# EAGLE design sbmcs-pcb (EAGLE 9.6.2)

## Sheet 1 of 4
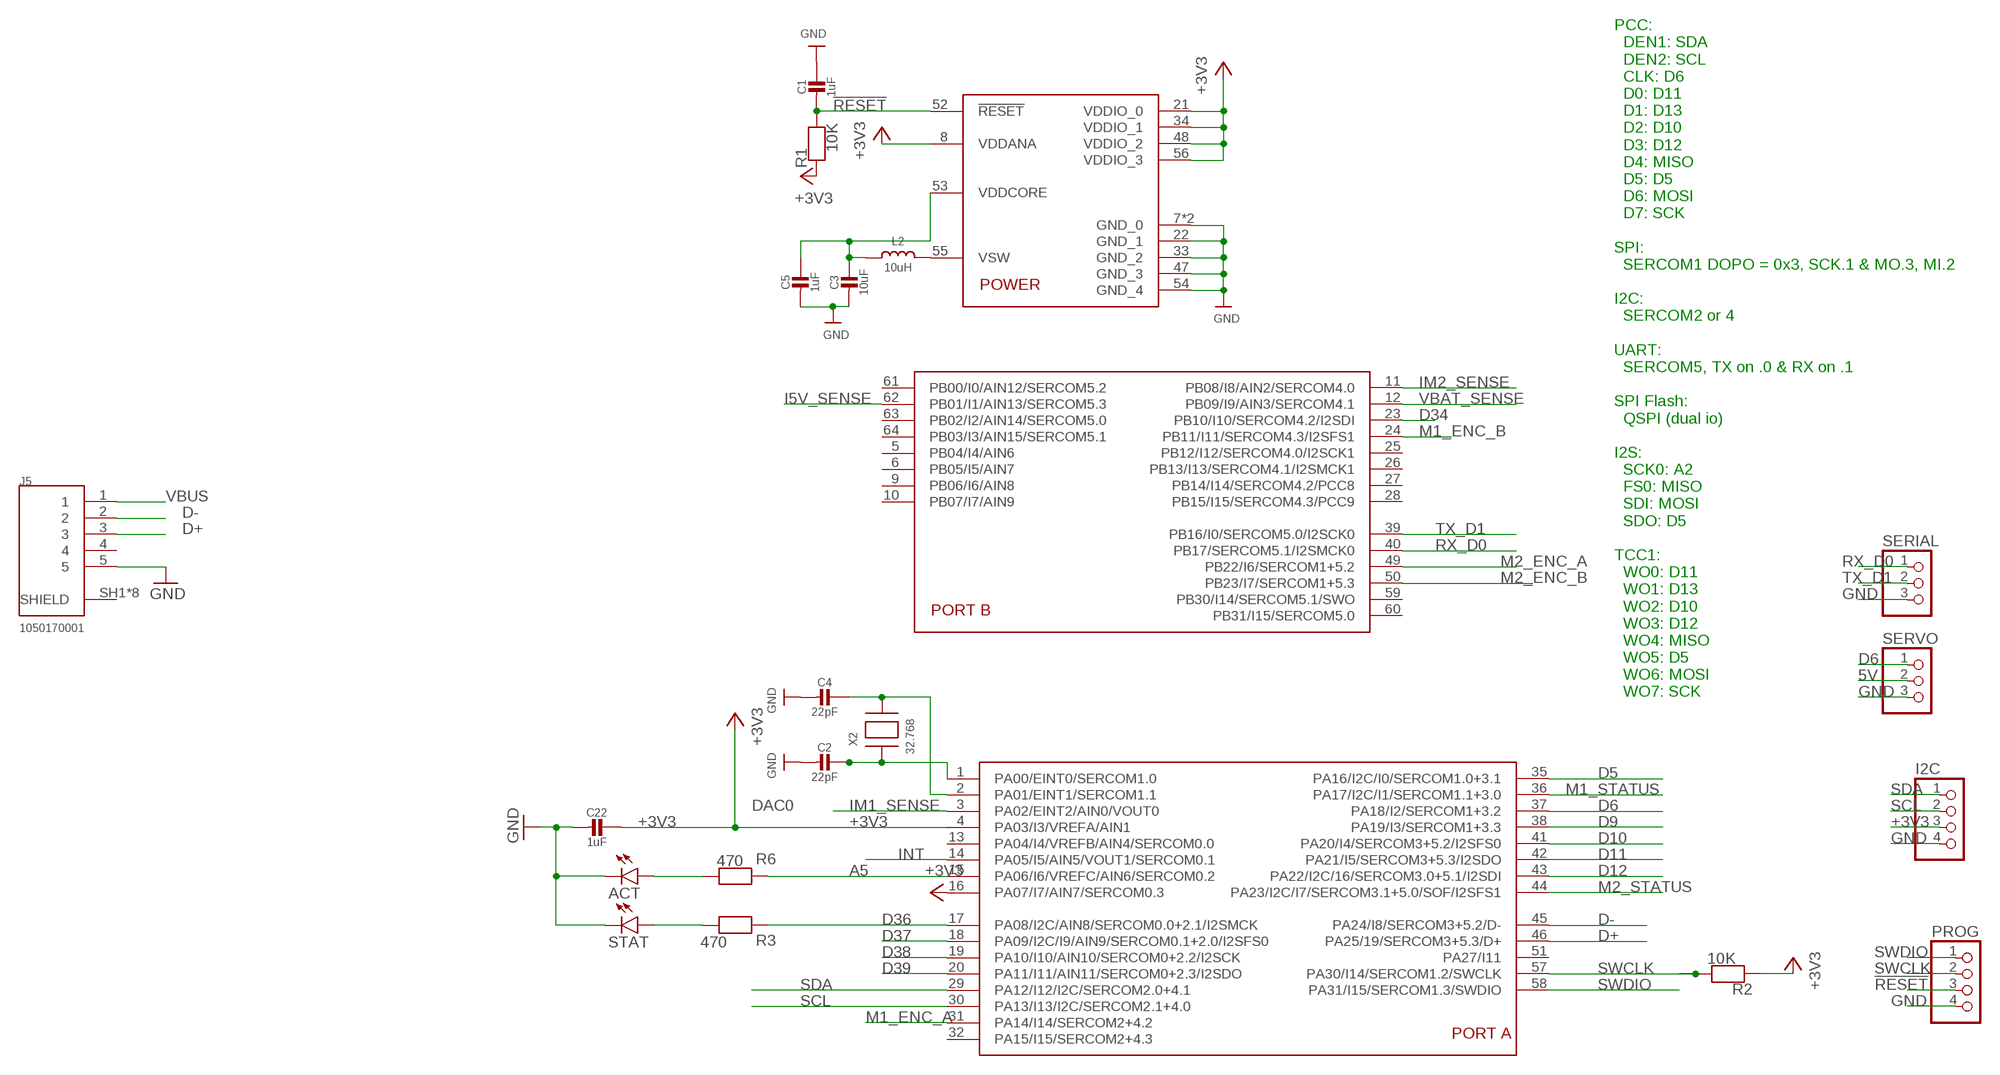
[diagram p0: schematic, sheet 1]

### Parts
ACT  LEDCHIPLED_0805  [CHIPLED_0805]
C1  1uF  CAP_CERAMIC0603_NO  [0603-NO]
C2  22pF  CAP_CERAMIC0603_NO  [0603-NO]
C3  10uF  CAP_CERAMIC0805-NOOUTLINE  [0805-NO]
C4  22pF  CAP_CERAMIC0603_NO  [0603-NO]
C5  1uF  CAP_CERAMIC0603_NO  [0603-NO]
C22  1uF  CAP_CERAMIC0603_NO  [0603-NO]
I2C  PINHD-1X4  [1X04]
J5  1050170001  [MOLEX_1050170001]
L2  10uH  INDUCTOR  [INDUCTOR_1007]
PROG  PINHD-1X4  [1X04]
R1  10K  RESISTOR_0603_NOOUT  [0603-NO]
R2  10K  RESISTOR_0603_NOOUT  [0603-NO]
R3  470  RESISTOR_0603_NOOUT  [0603-NO]
R6  470  RESISTOR_0603_NOOUT  [0603-NO]
SERIAL  PINHD-1X3  [1X03]
SERVO  PINHD-1X3  [1X03]
STAT  LEDCHIPLED_0805  [CHIPLED_0805]
U4  ATSAMD51J  [PQFN64-1]
X2  32.768  XTAL-3.2X1.5  [XTAL3215]

### Nets
5V: SERVO.2 ; also sheet 4
!RESET: C1.2 PROG.3 R1.2 U4.52(!RESET)
+3V3: C22.1 I2C.3 R1.1 R2.1 U4.4(PA03/I3/VREFA/AIN1) U4.8(VDDANA) U4.16(PA07/I7/AIN7/SERCOM0.3) U4.21(VDDIO_0) U4.34(VDDIO_1) U4.48(VDDIO_2) U4.56(VDDIO_3) ; also sheet 2,3,4
A5: R6.1 U4.15(PA06/I6/VREFC/AIN6/SERCOM0.2)
D5: U4.35(PA16/I2C/I0/SERCOM1.0+3.1)
D6: SERVO.1 U4.37(PA18/I2/SERCOM1+3.2)
D9: U4.38(PA19/I3/SERCOM1+3.3) ; also sheet 2
D10: U4.41(PA20/I4/SERCOM3+5.2/I2SFS0) ; also sheet 2
D11: U4.42(PA21/I5/SERCOM3+5.3/I2SDO) ; also sheet 2
D12: U4.43(PA22/I2C/16/SERCOM3.0+5.1/I2SDI) ; also sheet 2
D34: U4.23(PB10/I10/SERCOM4.2/I2SDI) ; also sheet 2
D36: R3.1 U4.17(PA08/I2C/AIN8/SERCOM0.0+2.1/I2SMCK)
D37: U4.18(PA09/I2C/I9/AIN9/SERCOM0.1+2.0/I2SFS0) ; also sheet 2
D38: U4.19(PA10/I10/AIN10/SERCOM0+2.2/I2SCK) ; also sheet 2
D39: U4.20(PA11/I11/AIN11/SERCOM0+2.3/I2SDO) ; also sheet 2
D+: J5.3 U4.46(PA25/19/SERCOM3+5.3/D+)
D-: J5.2 U4.45(PA24/I8/SERCOM3+5.2/D-)
GND: ACT.C C1.1 C2.2 C3.2 C4.2 C5.2 C22.2 I2C.4 J5.5 PROG.4 SERIAL.3 SERVO.3 STAT.C U4.7(GND_0) U4.22(GND_1) U4.33(GND_2) U4.47(GND_3) U4.54(GND_4) U4.EXP(GND_0) ; also sheet 2,3,4
I5V_SENSE: U4.62(PB01/I1/AIN13/SERCOM5.3) ; also sheet 4
IM1_SENSE: U4.3(PA02/EINT2/AIN0/VOUT0) ; also sheet 2
IM2_SENSE: U4.11(PB08/I8/AIN2/SERCOM4.0) ; also sheet 2
INT: U4.14(PA05/I5/AIN5/VOUT1/SERCOM0.1) ; also sheet 3
M1_ENC_A: U4.31(PA14/I14/SERCOM2+4.2) ; also sheet 2
M1_ENC_B: U4.24(PB11/I11/SERCOM4.3/I2SFS1) ; also sheet 2
M1_STATUS: U4.36(PA17/I2C/I1/SERCOM1.1+3.0) ; also sheet 2
M2_ENC_A: U4.49(PB22/I6/SERCOM1+5.2) ; also sheet 2
M2_ENC_B: U4.50(PB23/I7/SERCOM1+5.3) ; also sheet 2
M2_STATUS: U4.44(PA23/I2C/I7/SERCOM3.1+5.0/SOF/I2SFS1) ; also sheet 2
N$1: R3.2 STAT.A
N$2: ACT.A R6.2
N$5: C2.1 U4.1(PA00/EINT0/SERCOM1.0) X2.P$1
N$7: C4.1 U4.2(PA01/EINT1/SERCOM1.1) X2.P$2
N$11: L2.P$2 U4.55(VSW)
RX_D0: SERIAL.1 U4.40(PB17/SERCOM5.1/I2SMCK0)
SCL: I2C.2 U4.30(PA13/I13/I2C/SERCOM2.1+4.0) ; also sheet 3
SDA: I2C.1 U4.29(PA12/I12/I2C/SERCOM2.0+4.1) ; also sheet 3
SWCLK: PROG.2 R2.2 U4.57(PA30/I14/SERCOM1.2/SWCLK)
SWDIO: PROG.1 U4.58(PA31/I15/SERCOM1.3/SWDIO)
TX_D1: SERIAL.2 U4.39(PB16/I0/SERCOM5.0/I2SCK0)
VBAT_SENSE: U4.12(PB09/I9/AIN3/SERCOM4.1) ; also sheet 4
VBUS [power]: J5.1 ; also sheet 4
VDDCORE1: C3.1 C5.1 L2.P$1 U4.53(VDDCORE)
Unconnected: J5.4 J5.SH1(SHIELD) J5.SH2(SHIELD) J5.SH3(SHIELD) J5.SH4(SHIELD) J5.SH5(SHIELD) J5.SH6(SHIELD) J5.SH7(SHIELD) J5.SH8(SHIELD) U4.5(PB04/I4/AIN6) U4.6(PB05/I5/AIN7) U4.9(PB06/I6/AIN8) U4.10(PB07/I7/AIN9) U4.13(PA04/I4/VREFB/AIN4/SERCOM0.0) U4.25(PB12/I12/SERCOM4.0/I2SCK1) U4.26(PB13/I13/SERCOM4.1/I2SMCK1) U4.27(PB14/I14/SERCOM4.2/PCC8) U4.28(PB15/I15/SERCOM4.3/PCC9) U4.32(PA15/I15/SERCOM2+4.3) U4.51(PA27/I11) U4.59(PB30/I14/SERCOM5.1/SWO) U4.60(PB31/I15/SERCOM5.0) U4.61(PB00/I0/AIN12/SERCOM5.2) U4.63(PB02/I2/AIN14/SERCOM5.0) U4.64(PB03/I3/AIN15/SERCOM5.1)

### Notes on the sheet
- PCC:
    DEN1: SDA
    DEN2: SCL
    CLK: D6
    D0: D11
    D1: D13
    D2: D10
    D3: D12
    D4: MISO
    D5: D5
    D6: MOSI
    D7: SCK
  
  SPI:
    SERCOM1 DOPO = 0x3, SCK.1 & MO.3, MI.2
  
  I2C:
    SERCOM2 or 4
  
  UART:
    SERCOM5, TX on .0 & RX on .1
  
  SPI Flash:
    QSPI (dual io)
  
  I2S:
    SCK0: A2
    FS0: MISO
    SDI: MOSI
    SDO: D5
  
  TCC1:
    WO0: D11
    WO1: D13
    WO2: D10
    WO3: D12
    WO4: MISO
    WO5: D5
    WO6: MOSI
    WO7: SCK
- DAC0

## Sheet 2 of 4
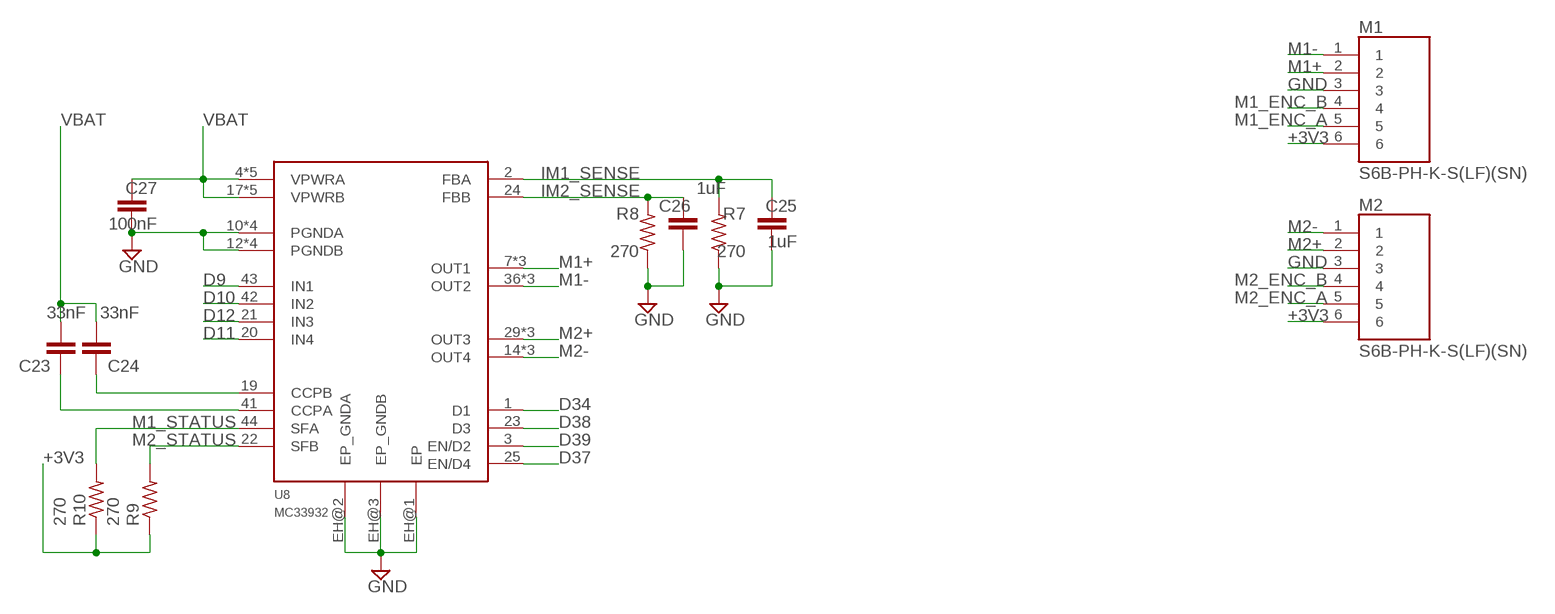
[diagram p1: schematic, sheet 2]

### Parts
C23  33nF  C-EUC0603  [C0603]
C24  33nF  C-EUC0603  [C0603]
C25  1uF  C-EUC0603  [C0603]
C26  1uF  C-EUC0603  [C0603]
C27  100nF  C-EUC0603  [C0603]
M1  S6B-PH-K-S(LF)(SN)  [JST_S6B-PH-K-S(LF)(SN)]
M2  S6B-PH-K-S(LF)(SN)  [JST_S6B-PH-K-S(LF)(SN)]
R7  270  R-US_R0603  [R0603]
R8  270  R-US_R0603  [R0603]
R9  270  R-US_R0603  [R0603]
R10  270  R-US_R0603  [R0603]
U8  MC33932  [HSOP44]

### Nets
+3V3: M1.6 M2.6 R9.1 R10.1 ; also sheet 1,3,4
D9: U8.43(IN1) ; also sheet 1
D10: U8.42(IN2) ; also sheet 1
D11: U8.20(IN4) ; also sheet 1
D12: U8.21(IN3) ; also sheet 1
D34: U8.1(D1) ; also sheet 1
D37: U8.25(EN/D4) ; also sheet 1
D38: U8.23(D3) ; also sheet 1
D39: U8.3(EN/D2) ; also sheet 1
GND: C25.1 C26.1 C27.1 M1.3 M2.3 R7.1 R8.1 U8.10(PGNDA) U8.11(PGNDA) U8.12(PGNDB) U8.13(PGNDB) U8.32(PGNDB) U8.33(PGNDB) U8.34(PGNDA) U8.35(PGNDA) U8.EH@1(EP) U8.EH@2(EP_GNDA) U8.EH@3(EP_GNDB) ; also sheet 1,3,4
IM1_SENSE: C25.2 R7.2 U8.2(FBA) ; also sheet 1
IM2_SENSE: C26.2 R8.2 U8.24(FBB) ; also sheet 1
M1+: M1.2 U8.7(OUT1) U8.8(OUT1) U8.9(OUT1)
M1-: M1.1 U8.36(OUT2) U8.37(OUT2) U8.38(OUT2)
M1_ENC_A: M1.5 ; also sheet 1
M1_ENC_B: M1.4 ; also sheet 1
M1_STATUS: R10.2 U8.44(SFA) ; also sheet 1
M2+: M2.2 U8.29(OUT3) U8.30(OUT3) U8.31(OUT3)
M2-: M2.1 U8.14(OUT4) U8.15(OUT4) U8.16(OUT4)
M2_ENC_A: M2.5 ; also sheet 1
M2_ENC_B: M2.4 ; also sheet 1
M2_STATUS: R9.2 U8.22(SFB) ; also sheet 1
N$30: C24.1 U8.41(CCPA)
N$31: C23.1 U8.19(CCPB)
VBAT: C23.2 C24.2 C27.2 U8.4(VPWRA) U8.5(VPWRA) U8.6(VPWRA) U8.17(VPWRB) U8.18(VPWRB) U8.26(VPWRB) U8.27(VPWRB) U8.28(VPWRB) U8.39(VPWRA) U8.40(VPWRA) ; also sheet 4

## Sheet 3 of 4
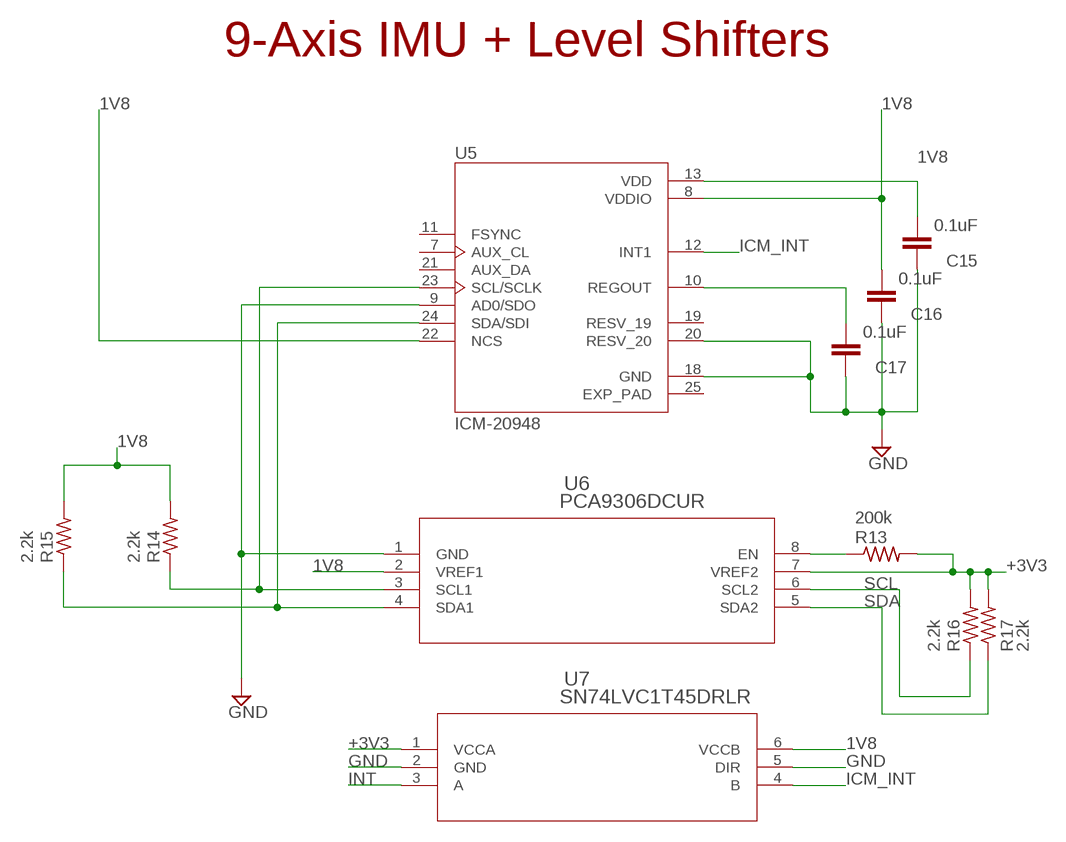
[diagram p2: schematic, sheet 3]

### Parts
C15  0.1uF  C-EUC0603  [C0603]
C16  0.1uF  C-EUC0603  [C0603]
C17  0.1uF  C-EUC0603  [C0603]
R13  200k  R-US_R0603  [R0603]
R14  2.2k  R-US_R0603  [R0603]
R15  2.2k  R-US_R0603  [R0603]
R16  2.2k  R-US_R0603  [R0603]
R17  2.2k  R-US_R0603  [R0603]
U5  ICM-20948  [QFN40P300X300X105-25N]
U6  PCA9306DCUR  [DCU8]
U7  SN74LVC1T45DRLR  [DRL6]

### Nets
1V8: C15.2 C16.2 R14.2 R15.2 U5.8(VDDIO) U5.13(VDD) U5.22(NCS) U6.2(VREF1) U7.6(VCCB) ; also sheet 4
+3V3: R13.2 R16.2 R17.2 U6.7(VREF2) U7.1(VCCA) ; also sheet 1,2,4
GND: C15.1 C16.1 C17.1 U5.9(AD0/SDO) U5.18(GND) U5.20(RESV_20) U6.1(GND) U7.2(GND) U7.5(DIR) ; also sheet 1,2,4
ICM_INT: U5.12(INT1) U7.4(B)
INT: U7.3(A) ; also sheet 1
N$13: R13.1 U6.8(EN)
N$15: C17.2 U5.10(REGOUT)
N$18: R14.1 U5.23(SCL/SCLK) U6.3(SCL1)
N$19: R15.1 U5.24(SDA/SDI) U6.4(SDA1)
SCL: R16.1 U6.6(SCL2) ; also sheet 1
SDA: R17.1 U6.5(SDA2) ; also sheet 1
Unconnected: U5.7(AUX_CL) U5.11(FSYNC) U5.19(RESV_19) U5.21(AUX_DA)

### Notes on the sheet
- 9-Axis IMU + Level Shifters

## Sheet 4 of 4
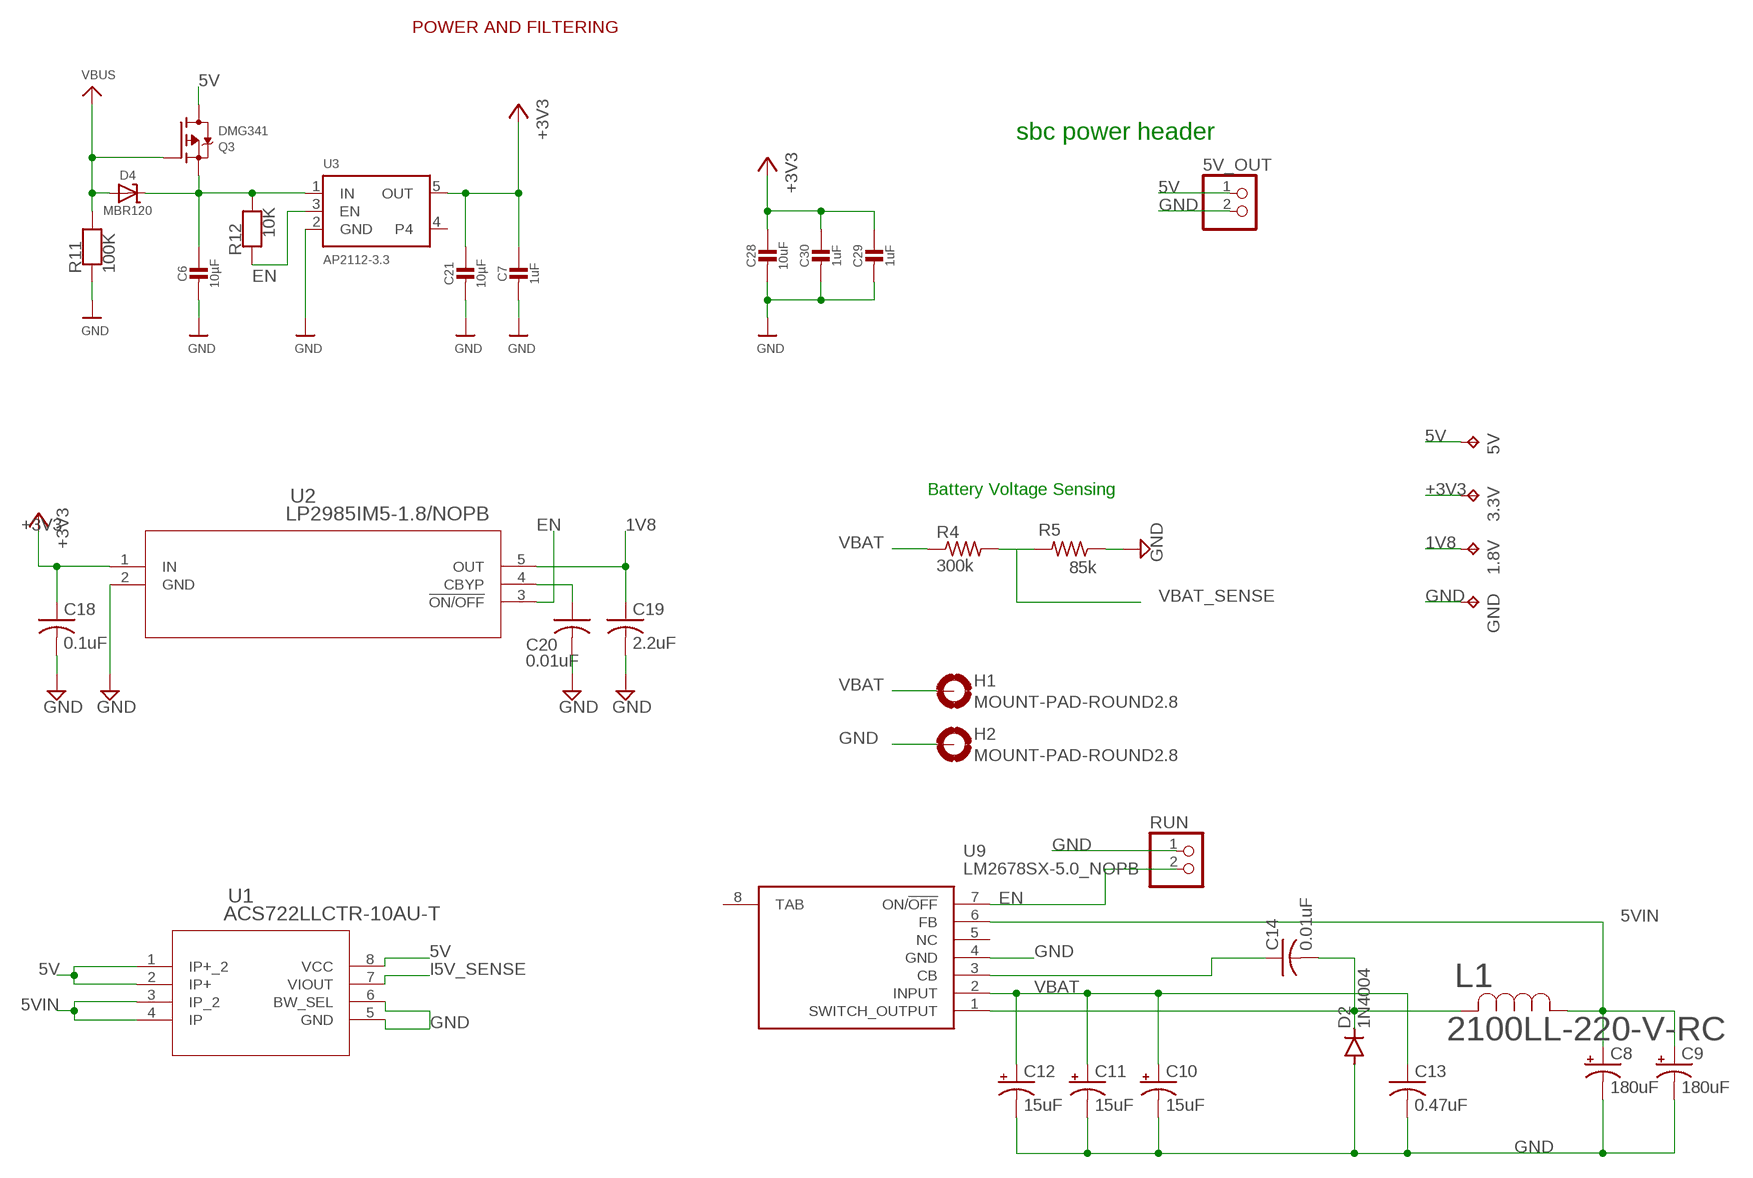
[diagram p3: schematic, sheet 4]

### Parts
1.8V  TPTP20R  [TP20R]
3.3V  TPTP20R  [TP20R]
5V  TPTP20R  [TP20R]
5V_OUT  PINHD-1X2  [1X02]
C6  10µF  CAP_CERAMIC0805-NOOUTLINE  [0805-NO]
C7  1uF  CAP_CERAMIC0603_NO  [0603-NO]
C8  180uF  CPOL-USE2.5-6  [E2,5-6]
C9  180uF  CPOL-USE2.5-6  [E2,5-6]
C10  15uF  CPOL-USE2.5-6  [E2,5-6]
C11  15uF  CPOL-USE2.5-6  [E2,5-6]
C12  15uF  CPOL-USE2.5-6  [E2,5-6]
C13  0.47uF  C-USC0603  [C0603]
C14  0.01uF  C-USC0603  [C0603]
C18  0.1uF  C-USC0603  [C0603]
C19  2.2uF  C-USC0603  [C0603]
C20  0.01uF  C-USC0603  [C0603]
C21  10µF  CAP_CERAMIC0805-NOOUTLINE  [0805-NO]
C28  10uF  CAP_CERAMIC0805-NOOUTLINE  [0805-NO]
C29  1uF  CAP_CERAMIC0603_NO  [0603-NO]
C30  1uF  CAP_CERAMIC0603_NO  [0603-NO]
D2  1N4004  [DO41-10]
D4  MBR120  DIODE-SCHOTTKYSOD-123  [SOD-123]
GND  TPTP20R  [TP20R]
H1  MOUNT-PAD-ROUND2.8  [2,8-PAD]
H2  MOUNT-PAD-ROUND2.8  [2,8-PAD]
L1  2100LL-220-V-RC  [IND_2100LL_42_V]
Q3  DMG341  MOSFET-P  [SOT23-R]
R4  300k  R-US_R0603  [R0603]
R5  85k  R-US_R0603  [R0603]
R11  100K  RESISTOR_0603_NOOUT  [0603-NO]
R12  10K  RESISTOR_0603_NOOUT  [0603-NO]
RUN  PINHD-1X2  [1X02]
U1  ACS722LLCTR-10AU-T  [SOICN-8_ALM]
U2  LP2985IM5-1.8/NOPB  [MF05A]
U3  AP2112-3.3  VREG_SOT23-5  [SOT23-5]
U9  LM2678SX-5.0_NOPB  [KTW0007B]

### Nets
1V8: 1.8V.TP C19.1 U2.5(OUT) ; also sheet 3
5V: 5V.TP 5V_OUT.1 Q3.3(D) U1.1(IP+_2) U1.2(IP+) U1.8(VCC) ; also sheet 1
5VIN: C8.+ C9.+ L1.1 U1.3(IP_2) U1.4(IP) U9.6(FB)
+3V3: 3.3V.TP C7.1 C18.1 C21.1 C28.1 C29.1 C30.1 U2.1(IN) U3.5(OUT) ; also sheet 1,2,3
EN: R12.1 RUN.2 U2.3(!ON/OFF) U3.3(EN) U9.7(ON/!OFF)
GND: 5V_OUT.2 C6.2 C7.2 C8.- C9.- C10.- C11.- C12.- C13.2 C18.2 C19.2 C20.2 C21.2 C28.2 C29.2 C30.2 D2.A GND.TP H2.B2,8(MOUNT) R5.1 R11.1 RUN.1 U1.5(GND) U1.6(BW_SEL) U2.2(GND) U3.2(GND) U9.4(GND) ; also sheet 1,2,3
I5V_SENSE: U1.7(VIOUT) ; also sheet 1
N$12: C20.1 U2.4(CBYP)
N$94: C14.1 U9.3(CB)
N$96: C14.2 D2.C L1.2 U9.1(SWITCH_OUTPUT)
VBAT: C10.+ C11.+ C12.+ C13.1 H1.B2,8(MOUNT) R4.1 U9.2(INPUT) ; also sheet 2
VBAT_SENSE: R4.2 R5.2 ; also sheet 1
VBUS [power]: D4.A Q3.1(G) R11.2 ; also sheet 1
VHI: C6.1 D4.C Q3.2(S) R12.2 U3.1(IN)
Unconnected: U3.4 U9.5(NC) U9.8(TAB)

### Notes on the sheet
- POWER AND FILTERING
- sbc power header
- Battery Voltage Sensing

## Power pins joined to a net without a drawn wire
EXP_PAD: U5.25(EXP_PAD)

## Library data of the parts
1.8V 3.3V 5V GND = testpad:TP: Test pad
5V_OUT RUN = pinhead:PINHD-1X2: PIN HEADER
ACT STAT = led:LED: LED OSRAM: - CHIPLED LG R971, LG N971, LY N971, LG Q971, LY Q971, LO R971, LY R971 LH N974, LH R974 LS Q976, LO Q976, LY Q976 LO Q996 - Hyper CHIPLED LW Q18S LB Q993, LB Q99A, LB R99A - SideLED LS A670, LO A670, LY A670, LG A670, LP A670 LB A673, LV A673, LT A673, LW A673 LH A674 LY A675 LS A676, LA A676, LO A676, LY A676, LW A676 LS A679, LY A679, LG A679 - Hyper Micro SIDELED® LS Y876, LA Y876, LO Y876, LY Y876 LT Y87S - SmartLED LW L88C, LW L88S LB L89C, LB L89S, LG L890 LS L89K, LO L89K, LY L89K LS L896, LA L896, LO L896, LY L896 - TOPLED LS T670, LO T670, LY T670, LG T670, LP T670 LSG T670, LSP T670, LSY T670, LOP T670, LYG T670 LG T671, LOG T671, LSG T671 LB T673, LV T673, LT T673, LW T673 LH T674 LS T676, LA T676, LO T676, LY T676, LB T676, LH T676, LSB T676, LW T676 LB T67C, LV T67C, LT T67C, LS T67K, LO T67K, LY T67K, LW E67C LS E67B, LA E67B, LO E67B, LY E67B, LB E67C, LV E67C, LT E67C LW T67C LS T679, LY T679, LG T679 LS T770, LO T770, LY T770, LG T770, LP T770 LB T773, LV T773, LT T773, LW T773 LH T774 LS E675, LA E675, LY E675, LS T675 LS T776, LA T776, LO T776, LY T776, LB T776 LHGB T686 LT T68C, LB T68C - Hyper Mini TOPLED® LB M676 - Mini TOPLED Santana® LG M470 LS M47K, LO M47K, LY M47K Source: http://www.osram.convergy.de LUXEON: - LUMILED® LXK2-PW12-R00, LXK2-PW12-S00, LXK2-PW14-U00, LXK2-PW14-V00 LXK2-PM12-R00, LXK2-PM12-S00, LXK2-PM14-U00 LXK2-PE12-Q00, LXK2-PE12-R00, LXK2-PE12-S00, LXK2-PE14-T00, LXK2-PE14-U00 LXK2-PB12-K00, LXK2-PB12-L00, LXK2-PB12-M00, LXK2-PB14-N00, LXK2-PB14-P00, LXK2-PB14-Q00 LXK2-PR12-L00, LXK2-PR12-M00, LXK2-PR14-Q00, LXK2-PR14-R00 LXK2-PD12-Q00, LXK2-PD12-R00, LXK2-PD12-S00 LXK2-PH12-R00, LXK2-PH12-S00 LXK2-PL12-P00, LXK2-PL12-Q00, LXK2-PL12-R00 Source: www.luxeon.com KINGBRIGHT: KA-3528ASYC Source: www.kingbright.com
C1-C7 C21 C22 C28-C30 = microbuilder:CAP_CERAMIC: Ceramic Capacitors For new designs, use the packages preceded by an '_' character since they are more reliable: The following footprints should be used on most boards: _0402 - Standard footprint for regular board layouts _0603 - Standard footprint for regular board layouts _0805 - Standard footprint for regular board layouts _1206 - Standard footprint for regular board layouts For extremely tight-pitch boards where space is at a premium, the following 'micro-pitch' footprints can be used (smaller pads, no silkscreen outline, etc.): _0402MP - Micro-pitch footprint for very dense/compact boards _0603MP - Micro-pitch footprint for very dense/compact boards _0805MP - Micro-pitch footprint for very dense/compact boards _1206MP - Micro-pitch footprint for very dense/compact boards
C8-C12 = adafruit:CPOL-US: POLARIZED CAPACITOR, American symbol
C13 C14 C18-C20 = rcl:C-US: CAPACITOR, American symbol; SPICEPREFIX: C
C15-C17 C23-C27 = rcl:C-EU: CAPACITOR, European symbol; SPICEPREFIX: C
D2 = diode:1N4004: DIODE general purpose rectifier, 1 A
D4 = microbuilder:DIODE-SCHOTTKY
H1 H2 = holes:MOUNT-PAD-ROUND: MOUNTING PAD, round
I2C PROG = pinhead:PINHD-1X4: PIN HEADER
J5 = MicroUSB:1050170001: Conn.; Data; USB; Recept.; Micro; B Type; Bottom Mount, SMT, with Solder Tabs, Lead-Free; DESCRIPTION: USB - micro B USB 2.0 Receptacle Connector 5 Position Surface Mount, Right Angle; Through Hole; DIGI-KEY_PART_NUMBER: WM1399CT-ND; DIGI-KEY_PURCHASE_URL: https://www.digikey.com/product-detail/en/molex/1050170001/WM1399CT-ND/2350885?utm_source=snapeda&utm_medium=aggregator&utm_campaign=symbol; MF: Molex; MP: 1050170001; PACKAGE: None
L1 = TI3VRegulator:2100LL-220-V-RC; BUILT_BY: EMA_UL_Team; MANUFACTURER_PART_NUMBER: 2100LL-220-V-RC; SOURCELIBRARY: Bourns_2010-01-01_IND_2100LL; VENDOR: Bourns Electronics
L2 = microbuilder:INDUCTOR: Inductors 0603: 10nH Ceramic Inductor - microwire antenna/RF (Digikey: 712-1434-2-ND) 0805: 560nH Ceramic Inductor - RF (Digikey: 553-1047-1-ND) 270nH Ceramic Inductor - Q = 40@250MHz, +-5%, 1 Ohm DC Resistance (Digikey: 535-10506-2-ND) 1007 (2518 Metric) SMT: 10µH 10% 250mOhm 820mA 1007 Inductor (Digikey: 587-2189-1-ND) 22µH 10% 500mOhm 580mA 1007 Inductor (Digikey: 587-2190-1-ND) 47µH 10% 950mOhm 420mA 1007 Inductor (Digikey: 587-2191-1-ND) 47µH 5% 100mOhm 1A 1008 Inductor (Digikey: 732-1816-1-ND) 5.0x5.0mm (Taiyo Yuden NR5040 Series) 6.8µH 20% 2.3A 64mOhm Inductor (Digikey: 587-2374-2-ND) 5.0x5.0mm (TDK VLC5045 Series) 4.7µH 20% 3.3A 34mOhm Inductor (Digikey: 445-6526-1-ND) 6.8µH 20% 2.7A 46mOhm Inductor (Digikey: 445-6527-1-ND) 6.0x6.0mm (TDK VLC6045 Series) 4.7µH 20% 3.8A 27mOhm Inductor (Digikey: 445-6538-2-ND) 6.8µH 20% 3A 41mOhm Inductor (Digikey: 445-6540-1-ND) 6.2µH 30% 2.2A 45mOhm Inductor (Digikey: SRR5028-6R2YCT-ND) - Not TDK VLC6045 but footprint should match 6.0x6.0mm (TDK SLF6045 Series) 6.8uH 30% 2A 33mOhm Inductor (Digikey: 445-4572-1-ND, Mouser: 810-SLF645T6R8N2R0PF) 6.0x6.0mm (Sumida CDRH5D28 Series) 6.2uH 30% 1.8A 45mOhm Inductor (Digikey: 308-1542-1-ND) Taiyo Yuden NR3015T2R2M - 2.2uH 20% 1.5A (Digikey: 587-1648-2-ND, Mouser: 963-NR3015T2R2M) - Used with TI TPS62172 CoilCraft RFID Transponder Coil - MA5532-AE (For use with AS3935 Lightning Sensor) Taiyo Yuden NRH2412T2R2MNGH - 2.2uH 20% 1AA (Digikey: 587-3443-1-ND) - Used with TI LM3671 Vishay IHLP 1.0uH Molded Inductor - 24mOhm DCR, 5A, +/-20%, -55°C-125°C (Digikey: 541-1319-1-ND)
M1 M2 = S6B-PH-K-S_LF__SN_:S6B-PH-K-S(LF)(SN): PH Series 6 Position 2 mm Pitch Through Hole Side Entry Shrouded Header; DESCRIPTION: Connector Header Through Hole, Right Angle 6 position 0.079 _2.00mm_; DIGI-KEY_PART_NUMBER: 455-1723-ND; DIGI-KEY_PURCHASE_URL: https://www.digikey.com/product-detail/en/jst-sales-america-inc/S6B-PH-K-S_LF__SN_/455-1723-ND/926630?utm_source=snapeda&utm_medium=aggregator&utm_campaign=symbol; MF: JST Sales; MP: S6B-PH-K-S_LF__SN_; PACKAGE: None
Q3 = microbuilder:MOSFET-P: P-Channel Mosfet LEGEND VDS: Voltage Drain-Source ID: Drain Current RDS(ON): Drain-Source On-State Resistance VGS(TH): Gate-Source Threshold Voltage CISS: Drain-Source Input Capacitance SOT-23 Name VDS ID RDS(ON) VGS(TH) CISS Order Number IRLML5103 30V 760mA 600 mOhm -- 75pF @ 25V Digikey: IRLML5103PBFCT-ND IRLML6401 12V 4.3A 50 mOhm 950mV @ 250µA 830pF @ 10V Digikey: IRLML6401PBFTR-ND NTR0202PL 20V 400mA 800 mOhm 2.3V @ 250uA 70pF @ 5V Digikey: NTR0202PLT1GOSTR-ND NTR4101PT1G 20V 1.8A 85 mOhm 1.2V @ 250uA 675pF @ 10V Digikey: NTR4101PT1GOSCT-ND DMP2004K 20V 600mA 900 mOhm 1V @ 250uA 175pF @ 16V Digikey: DMP2004KDICT-ND PMV65XP 20V 3.9A 76 mOhm 950mV @ 1mA 725pF @ 20V Digikey: 568-2358-2-ND TO-252 Name VDS ID RDS(ON) VGS(TH) CISS Order Number AOD417 30V 25A 34 mOhm 3V @ 250µA 920pF @ 15V Digikey: 785-1106-2-ND PowerPak Name VDS ID RDS(ON) VGS(TH) CISS Order Number AON7401 30V 12A 14 mOhm 3V @ 250µA 2600pF @ 15V Digikey: 785-1302-1-ND
R1-R3 R6 R11 R12 = microbuilder:RESISTOR: Resistors For new designs, use the packages preceded by an '_' character since they are more reliable: The following footprints should be used on most boards: _0402 - Standard footprint for regular board layouts _0603 - Standard footprint for regular board layouts _0805 - Standard footprint for regular board layouts _1206 - Standard footprint for regular board layouts For extremely tight-pitch boards where space is at a premium, the following 'micro-pitch' footprints can be used (smaller pads, no silkscreen outline, etc.): _0402MP - Micro-pitch footprint for very dense/compact boards _0603MP - Micro-pitch footprint for very dense/compact boards _0805MP - Micro-pitch footprint for very dense/compact boards _1206MP - Micro-pitch footprint for very dense/compact boards
R4 R5 = adafruit:R-US_: RESISTOR, American symbol
R7-R10 R13-R17 = rcl:R-US_: RESISTOR, American symbol; SPICEPREFIX: R
SERIAL SERVO = pinhead:PINHD-1X3: PIN HEADER
U1 = ACS763:ACS722LLCTR-10AU-T; BUILT_BY: EMA_Molly; COPYRIGHT: Copyright (C) 2018 Accelerated Designs. All rights reserved; MANUFACTURER_PART_NUMBER: ACS722LLCTR-10AU-T; SOURCELIBRARY: Allegro_2019-12-17; VENDOR: Allegro Microsystems Inc.
U2 = gsynth:LP2985IM5-1.8/NOPB; MANUFACTURER_PART_NUMBER: LP2985IM51.8NOPB; VENDOR: Texas Instruments
U3 = microbuilder:VREG_SOT23-5: SOT23-5 Fixed Voltage Regulators Part Current Out V Out V In V Dropout θJA (°C/W) TJ (°C) Digikey Part No. ADP121 150mA 3.3V 3.4-5.5V 0.09V @ 150mA -- -- ADP121-AUJZ33R7CT-ND ADP121 150mA 3.0V 3.1-5.5V 0.09V @ 150mA -- -- ADP121-AUJZ30R7CT-ND ADP122 300mA 3.3V 3.4-5.5V 0.085V @ 300mA -- -- ADP122AUJZ-3.3-R7CT-ND ADP1712 300mA 3.3V 3.5-5.5V 0.17V @ 300mA -- -- ADP1712AUJZ-3.3-R7TR-ND AP7311 (Low Cost) 150mA 3.3V 3.5-6V 0.15V @ 150mA -- -- AP7311-33WG-7DICT-ND LD39015M18R 150mA 1.8V 1.9V-5.5V 0.08V @ 100mA -- -- 497-6977-1-ND LP2985A-33DBVR 150mA 3.3V 3.3-16V 0.28V @ 150mA 206 150 296-18479-1-ND MCP1824T-3302E/OT 300mA 3.3V 3.5V-6V 0.2V @ 300mA -- -- MCP1824T-3302E/OTCT-ND MIC5205-2.5YM5 TR 150mA 2.5V 2.7-16V 0.165V @ 150mA -- -- 576-1257-2-ND MIC5205-3.0YM5 TR 150mA 3.0V 3.2V-16V 0.165V @ 150mA -- -- 576-1258-2-ND MIC5205-3.3YM5 TR 150mA 3.3V 3.5V-16V 0.165V @ 150mA -- -- 576-1259-2-ND TPS780330220 150mA 3.3V+2.2V 3.6-5.5V 250mV Max -- -- 296-23332-1-ND TDA3663/N1,135 100mA 3.3V 3.5-45V 0.18V @ 50mA -- -- 568-5343-1-ND Max operating temp can be calculated using θJA, TJ (max junction temperature), and power in watts. Set the "Maximum Ambient Temperature" until it reaches TJ ("Max Junction Temperature"), which is the absolute limit for safe use of the regulator: Heat Sink Temperature Calculator <http://www.daycounter.com/Calculators/Heat-Sink-Temperature-Calculator.phtml> For example, With 12V source into a 3.3V LP2985 and a 30mA load, we are dissipating (12V-3.3V) * 0.03A = 0.261W. With a θJA of 206 °C/W, a TJ of 150°C, and 261mW we can safely use the chip without a heat sink up to 75°C (=147.1°C Junction Temperature).
U4 = microbuilder:ATSAMD51J: ATSAMD51J cortex m4 microcontroller
U5 = ICM-20948:ICM-20948: Axis=3 Axis Gyro+3 Axis Accel+Compass. Pin For Pin With m; DESCRIPTION: 9 Axis=3 Axis Gyro+3 Axis Accel+Compass. Pin For Pin With m; DIGI-KEY_PART_NUMBER: 1428-1123-1-ND; DIGI-KEY_PURCHASE_URL: https://www.digikey.com/product-detail/en/tdk-invensense/ICM-20948/1428-1123-1-ND/7062698?utm_source=snapeda&utm_medium=aggregator&utm_campaign=symbol; MF: TDK InvenSense; MP: ICM-20948; PACKAGE: QFN-24 InvenSense
U6 = gsynth:PCA9306DCUR; MANUFACTURER_PART_NUMBER: PCA9306DCUR; VENDOR: Texas Instruments
U7 = gsynth:SN74LVC1T45DRLR; MANUFACTURER_PART_NUMBER: SN74LVC1T45DRLR; VENDOR: Texas Instruments
U8 = samdg:MC33932
U9 = SamacSys_Parts:LM2678SX-5.0_NOPB: SIMPLE SWITCHER 8V to 40V, 5A High Efficiency Step-Down DC/DC Switching Regulator Source: Datasheet <http://www.ti.com/lit/gpn/lm2678>; DESCRIPTION: SIMPLE SWITCHER 8V to 40V, 5A High Efficiency Step-Down DC/DC Switching Regulator; HEIGHT: mm; MANUFACTURER_NAME: Texas Instruments; MANUFACTURER_PART_NUMBER: LM2678SX-5.0/NOPB; MOUSER_PART_NUMBER: 926-LM2678SX50NOPB; MOUSER_PRICE-STOCK: https://www.mouser.com/Search/Refine.aspx?Keyword=926-LM2678SX50NOPB
X2 = adafruit2:XTAL: Low cost SMT crystals, no capacitors included http://www.ladyada.net/library/eagle

## Net classes
1 power: width 0.305 mm
2 gnd: width 0.254 mm

## Board
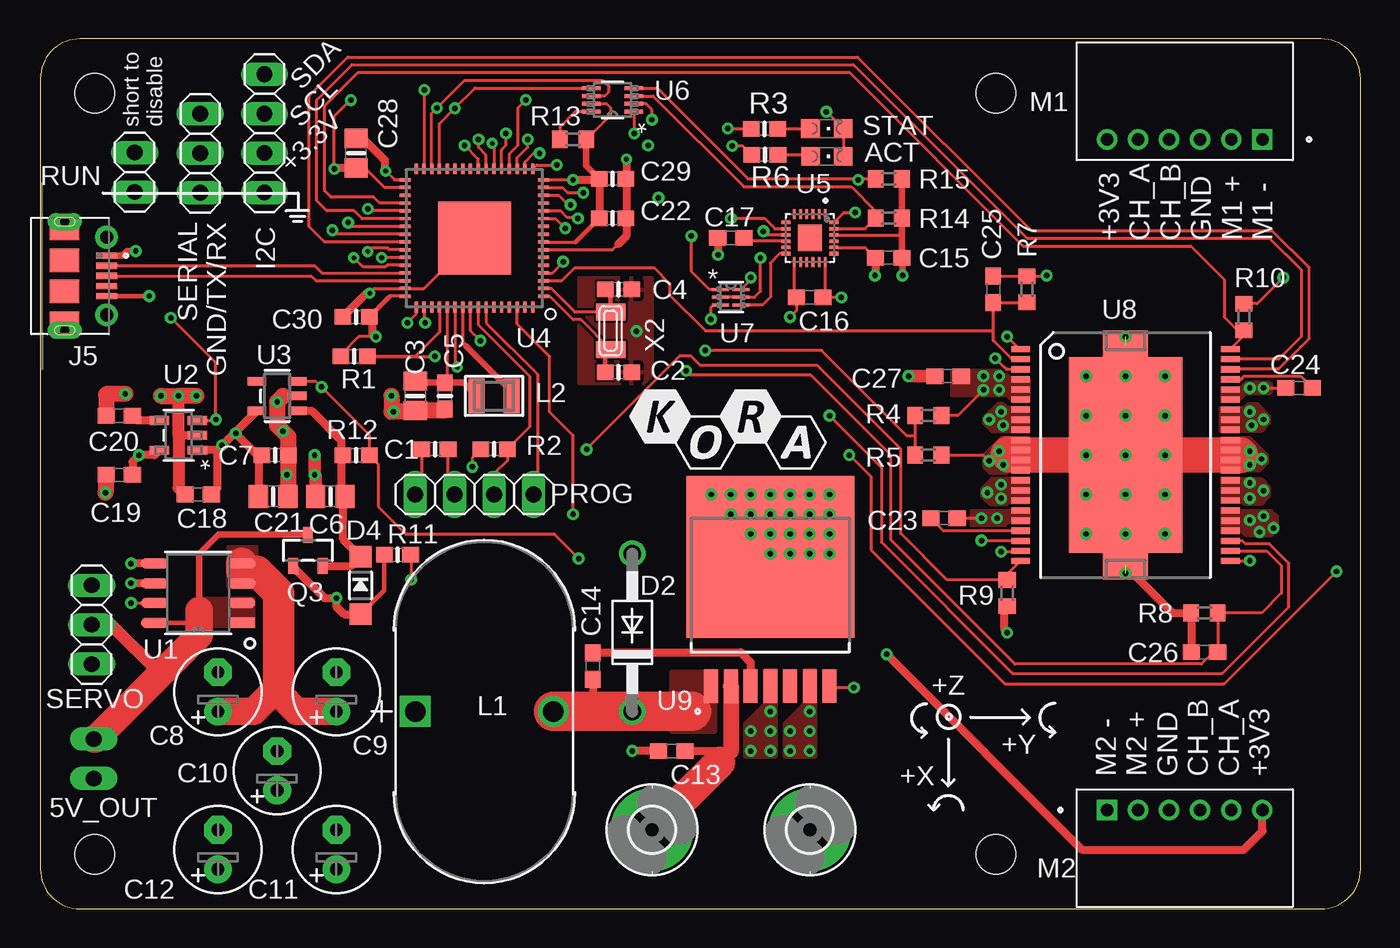
[diagram p4: board, top side]
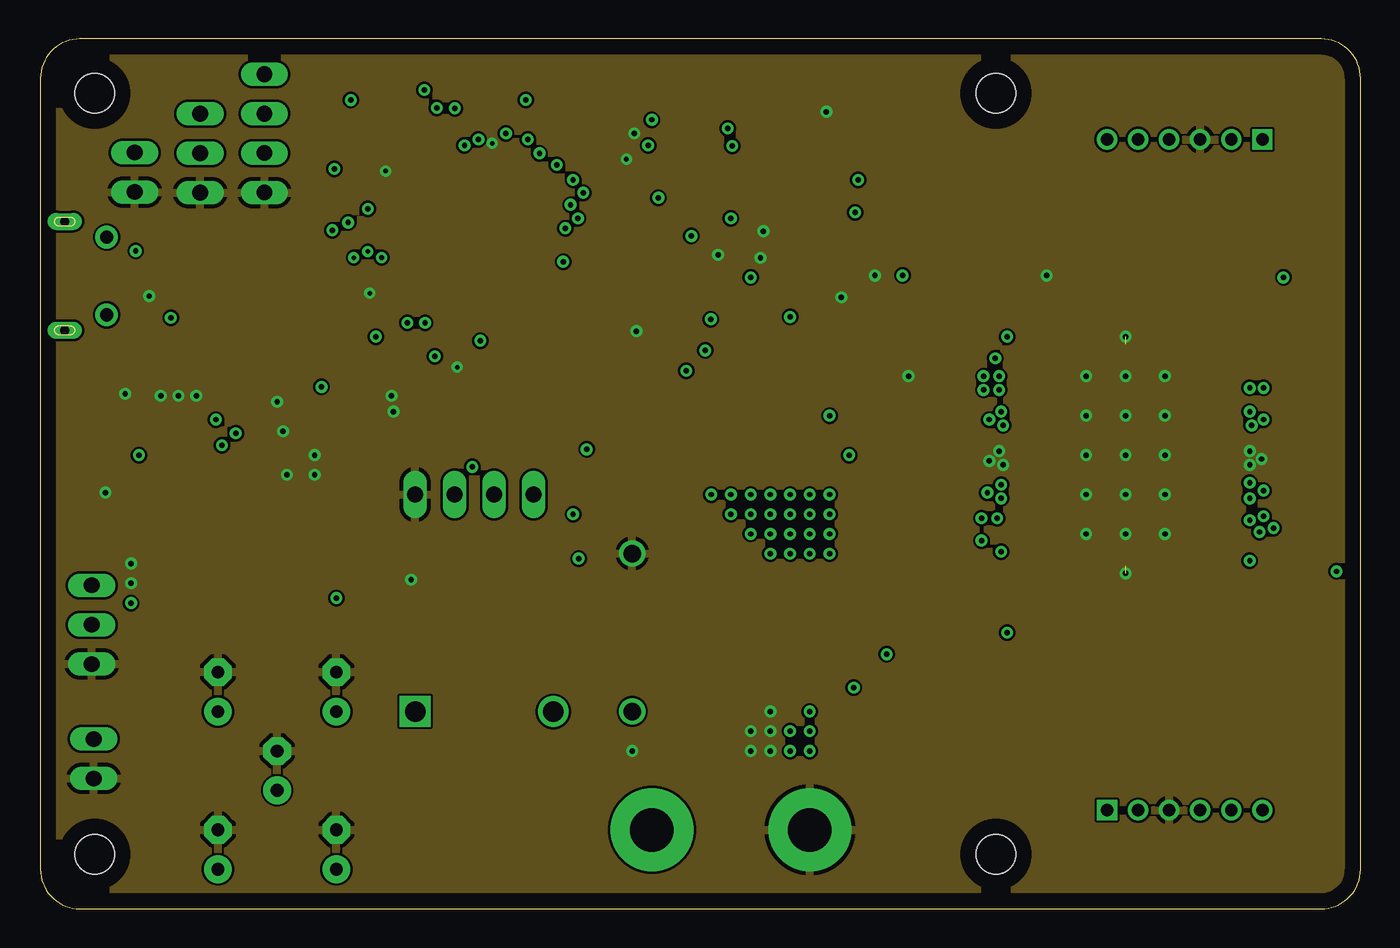
[diagram p5: board, inner layer Route2]
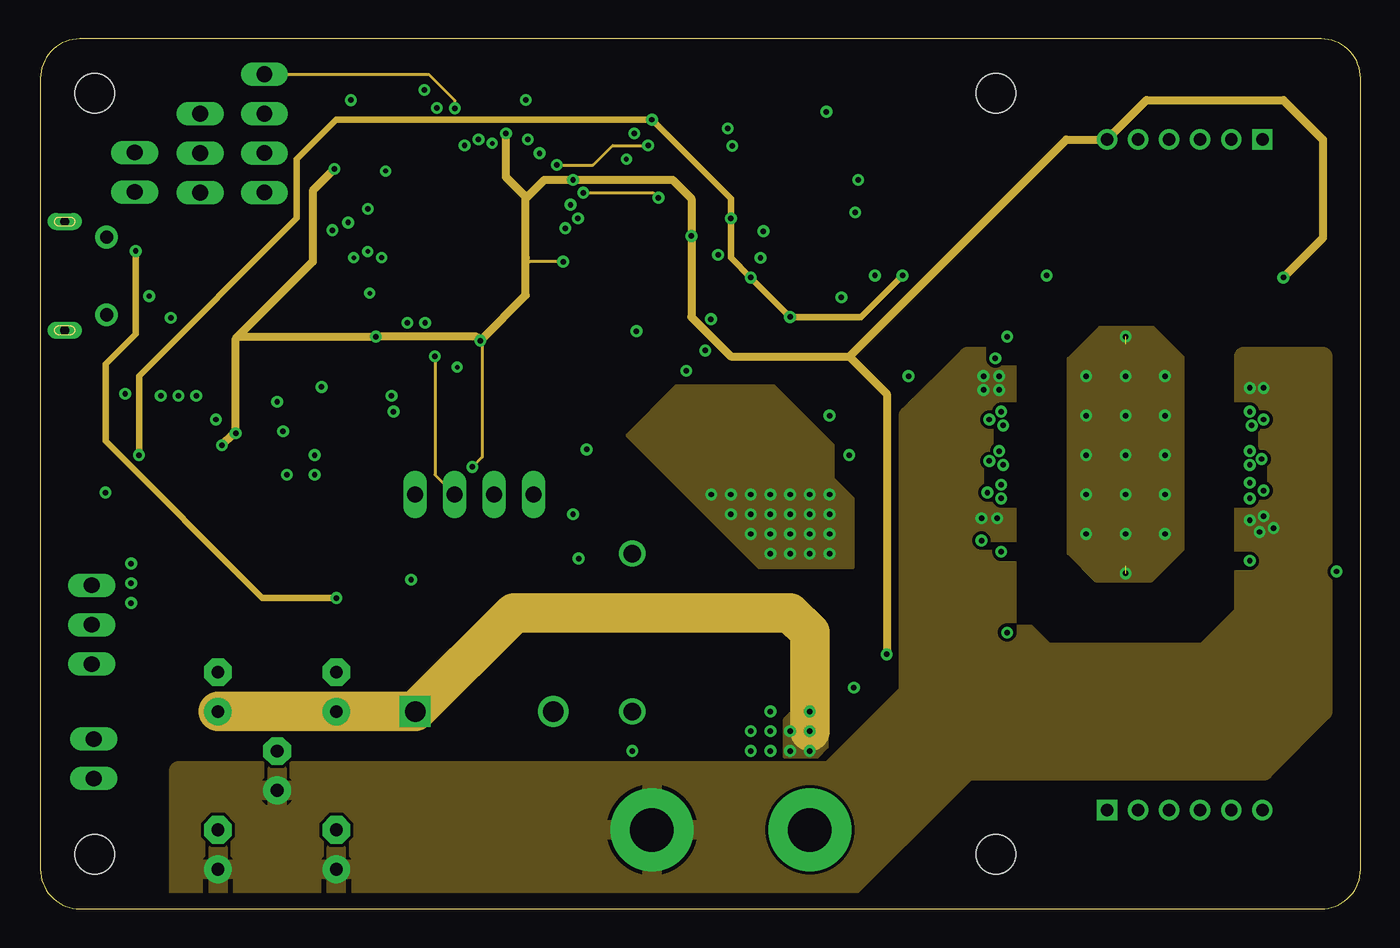
[diagram p6: board, inner layer Route15]
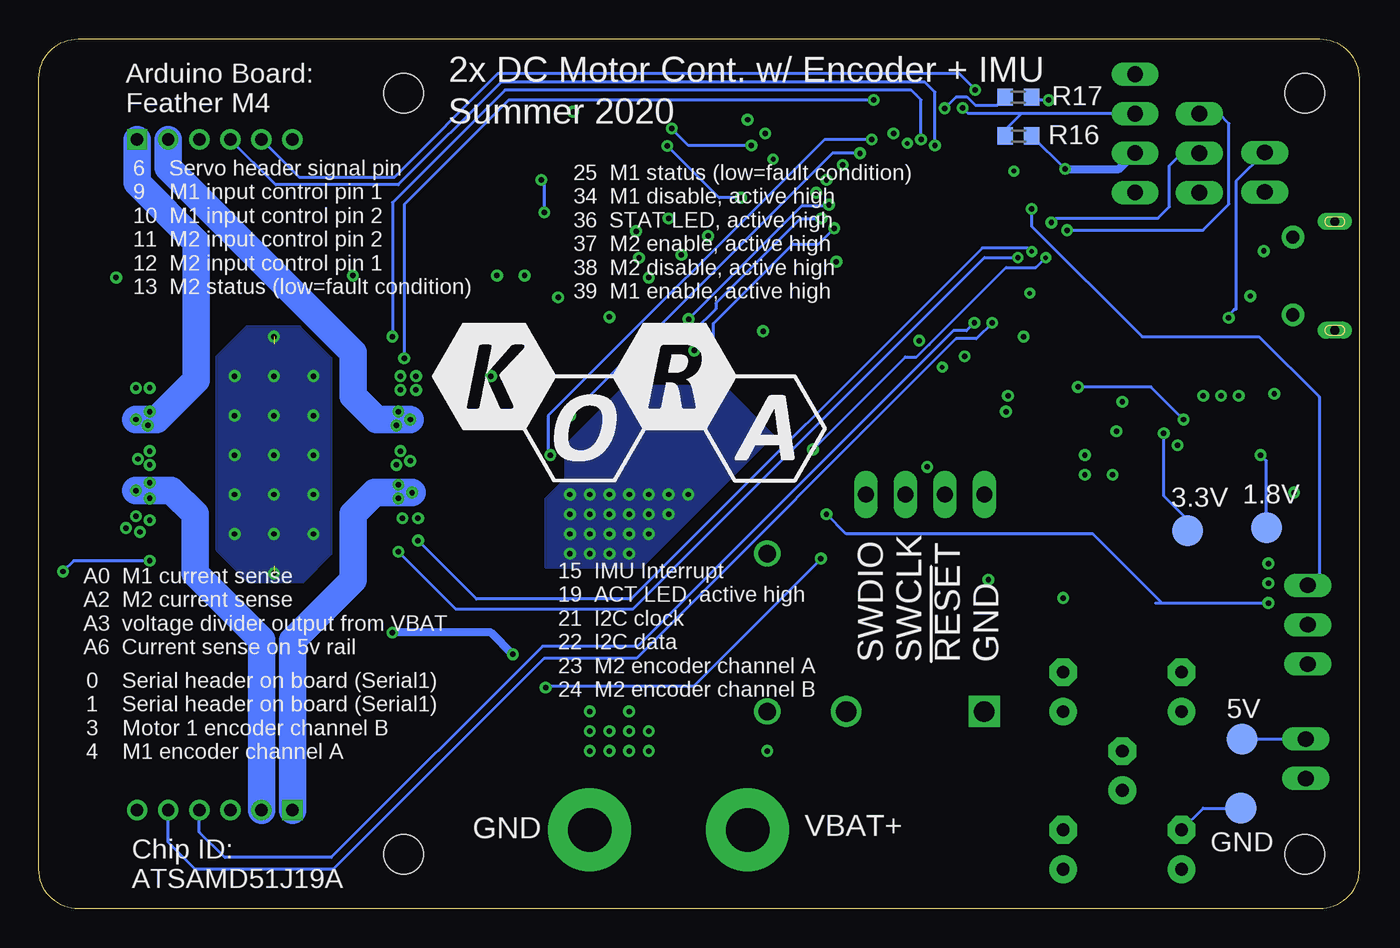
[diagram p7: board, bottom side, seen from below]

Size 84.99 x 56.01 mm. Coordinates in mm from the lower left corner, seen from the top.
Outline: 0,53.47 0,2.54 arc90 2.54,0 82.45,0 arc90 84.99,2.54 84.99,53.47 arc90 82.45,56.01 2.54,56.01 arc90 0,53.47
Copper layers (1+2*15+16): Top 0.035mm / dielectric 0.11mm / Route2 0.035mm / dielectric 1.13mm / Route15 0.035mm / dielectric 0.11mm / Bottom 0.035mm
Design rules "default *": minimum track width 6mil, minimum drill 0.35mm, track to track 6mil, track to pad 6mil, pad to pad 6mil, via to via 6mil, smd to smd 6mil, copper to edge 40mil, drill to drill 6mil, minimum pad ring 10mil, minimum via ring 8mil, stop-mask expansion 4mil, vias tented up to drill 14mil, thermal gap 10mil
Holes 2.54 mm at 3.51,3.51 3.51,52.5 61.49,52.5 61.49,3.51

### Footprints (pad centres in the part's own frame; a part is rotated, then mirrored left to right if it is on the bottom)
TP20R = smd 2 x 2: TP 0,0
1X02 = drill 1.016 long: 1 -1.27,0; 2 1.27,0
CHIPLED_0805 = smd 1.2 x 1.2: A 0,-1.05; C 0,1.05
0603-NO = smd 1.075 x 1: 1 -0.85,0; 2 0.85,0
0805-NO = smd 1.24 x 1.5: 1 -0.95,0; 2 0.95,0
E2,5-6 = drill 0.813 pad 1.778: + -1.27,0 | drill 0.813 pad 1.778 octagon: - 1.27,0
C0603 = smd 1.1 x 1: 1 -0.85,0; 2 0.85,0
DO41-10 = drill 1.118: A 5.08,0; C -5.08,0
SOD-123 = smd 1.4 x 1.4: A 1.85,0; C -1.85,0
2,8-PAD = drill 2.8 pad 5.334: B2,8 0,0
1X04 = drill 1.016 long: 1 -3.81,0; 2 -1.27,0; 3 1.27,0; 4 3.81,0
MOLEX_1050170001 = smd 0.4 x 1.35: 1 -1.3,2.35; 2 -0.65,2.35; 3 0,2.35; 4 0.65,2.35; 5 1.3,2.35 | drill 0.85 pad 1.45: SH1 -2.5,2.35; SH2 2.5,2.35 | drill 0.6 pad 0.95 long: SH3 -3.5,-0.35; SH8 3.5,-0.35 | smd 1.2 x 1.9: SH4 -2.9,-0.35; SH7 2.9,-0.35 | smd 1.5 x 1.9: SH5 -1,-0.35; SH6 1,-0.35
IND_2100LL_42_V = drill 1.321 pad 1.829 square: 1 0,0 | drill 1.321 pad 1.829: 2 8.89,0
INDUCTOR_1007 = smd 1.016 x 2.2: P$1 -1.127,0; P$2 1.127,0
JST_S6B-PH-K-S(LF)(SN) = drill 0.8 pad 1.2 square: 1 -5,0 | drill 0.8 pad 1.2: 2 -3,0; 3 -1,0; 4 1,0; 5 3,0; 6 5,0
SOT23-R = smd 0.635 x 1.016: 1 -0.95,-1; 2 0.95,-1; 3 0,1
R0603 = smd 1 x 1.1: 1 -0.85,0; 2 0.85,0
1X03 = drill 1.016 long: 1 -2.54,0; 2 0,0; 3 2.54,0
SOICN-8_ALM = smd 1.753 x 0.66: 1 -2.794,1.905; 2 -2.794,0.635; 3 -2.794,-0.635; 4 -2.794,-1.905; 5 2.794,-1.905; 6 2.794,-0.635; 7 2.794,0.635; 8 2.794,1.905
MF05A = smd 1.27 x 0.559: 1 -1.219,0.953; 2 -1.219,0; 3 -1.219,-0.953; 4 1.219,-0.953; 5 1.219,0.953
SOT23-5 = smd 0.55 x 1.2: 1 -0.95,-1.3; 2 0,-1.3; 3 0.95,-1.3; 4 0.95,1.3; 5 -0.95,1.3
PQFN64-1 = smd 0.7 x 0.22: 1 -4.45,3.75; 2 -4.45,3.25; 3 -4.45,2.75; 4 -4.45,2.25; 5 -4.45,1.75; 6 -4.45,1.25; 7 -4.45,0.75; 8 -4.45,0.25; 9 -4.45,-0.25; 10 -4.45,-0.75; 11 -4.45,-1.25; 12 -4.45,-1.75; 13 -4.45,-2.25; 14 -4.45,-2.75; 15 -4.45,-3.25; 16 -4.45,-3.75; 33 4.45,-3.75; 34 4.45,-3.25; 35 4.45,-2.75; 36 4.45,-2.25; 37 4.45,-1.75; 38 4.45,-1.25; 39 4.45,-0.75; 40 4.45,-0.25; 41 4.45,0.25; 42 4.45,0.75; 43 4.45,1.25; 44 4.45,1.75; 45 4.45,2.25; 46 4.45,2.75; 47 4.45,3.25; 48 4.45,3.75 | smd 0.22 x 0.7: 17 -3.75,-4.45; 18 -3.25,-4.45; 19 -2.75,-4.45; 20 -2.25,-4.45; 21 -1.75,-4.45; 22 -1.25,-4.45; 23 -0.75,-4.45; 24 -0.25,-4.45; 25 0.25,-4.45; 26 0.75,-4.45; 27 1.25,-4.45; 28 1.75,-4.45; 29 2.25,-4.45; 30 2.75,-4.45; 31 3.25,-4.45; 32 3.75,-4.45; 49 3.75,4.45; 50 3.25,4.45; 51 2.75,4.45; 52 2.25,4.45; 53 1.75,4.45; 54 1.25,4.45; 55 0.75,4.45; 56 0.25,4.45; 57 -0.25,4.45; 58 -0.75,4.45; 59 -1.25,4.45; 60 -1.75,4.45; 61 -2.25,4.45; 62 -2.75,4.45; 63 -3.25,4.45; 64 -3.75,4.45 | smd 4.7 x 4.7: EXP 0,0
QFN40P300X300X105-25N = smd 0.64 x 0.22: 1 -1.545,1; 2 -1.545,0.6; 3 -1.545,0.2; 4 -1.545,-0.2; 5 -1.545,-0.6; 6 -1.545,-1; 13 1.545,-1; 14 1.545,-0.6; 15 1.545,-0.2; 16 1.545,0.2; 17 1.545,0.6; 18 1.545,1 | smd 0.22 x 0.64: 7 -1,-1.545; 8 -0.6,-1.545; 9 -0.2,-1.545; 10 0.2,-1.545; 11 0.6,-1.545; 12 1,-1.545; 19 1,1.545; 20 0.6,1.545; 21 0.2,1.545; 22 -0.2,1.545; 23 -0.6,1.545; 24 -1,1.545 | smd 1.7 x 1.54: 25 0,0
DCU8 = smd 1.168 x 0.254: 1 -1.372,0.75; 2 -1.372,0.25; 3 -1.372,-0.25; 4 -1.372,-0.75; 5 1.372,-0.75; 6 1.372,-0.25; 7 1.372,0.25; 8 1.372,0.75
DRL6 = smd 1.092 x 0.203: 1 -0.66,0.5; 2 -0.66,0; 3 -0.66,-0.5; 4 0.66,-0.5; 5 0.66,0; 6 0.66,0.5
HSOP44 = smd 0.4 x 1.2: 1 -6.825,-6.75; 2 -6.175,-6.75; 3 -5.525,-6.75; 4 -4.875,-6.75; 5 -4.225,-6.75; 6 -3.575,-6.75; 7 -2.925,-6.75; 8 -2.275,-6.75; 9 -1.625,-6.75; 10 -0.975,-6.75; 11 -0.325,-6.75; 12 0.325,-6.75; 13 0.975,-6.75; 14 1.625,-6.75; 15 2.275,-6.75; 16 2.925,-6.75; 17 3.575,-6.75; 18 4.225,-6.75; 19 4.875,-6.75; 20 5.525,-6.75; 21 6.175,-6.75; 22 6.825,-6.75; 23 6.825,6.75; 24 6.175,6.75; 25 5.525,6.75; 26 4.875,6.75; 27 4.225,6.75; 28 3.575,6.75; 29 2.925,6.75; 30 2.275,6.75; 31 1.625,6.75; 32 0.975,6.75; 33 0.325,6.75; 34 -0.325,6.75; 35 -0.975,6.75; 36 -1.625,6.75; 37 -2.275,6.75; 38 -2.925,6.75; 39 -3.575,6.75; 40 -4.225,6.75; 41 -4.875,6.75; 42 -5.525,6.75; 43 -6.175,6.75; 44 -6.825,6.75 | smd 12.6 x 7.3: EH@1 0,0 | smd 1.7 x 2.9: EH@2 -7.15,0; EH@3 7.15,0
KTW0007B = smd 2.16 x 0.91: 1 2.175,-8.89; 2 2.175,-7.62; 3 2.175,-6.35; 4 2.175,-5.08; 5 2.175,-3.81; 6 2.175,-2.54; 7 2.175,-1.27 | smd 10.41 x 10.8: 8 -6.145,-5.08
XTAL3215 = smd 1.1 x 1.9: P$1 1.2,0; P$2 -1.2,0

### Placement (x,y rotation side)
1.8V  5.97,24.53 0 bottom
3.3V  11.05,24.34 0 bottom
5V  7.54,10.94 0 bottom
5V_OUT  3.43,9.65 270 top
ACT  50.64,48.44 270 top
C1  25.4,29.59 0 top
C2  37.21,34.54 0 top
C3  24.13,33.02 270 top
C4  37.21,39.88 0 top
C5  26.04,33.02 270 top
C6  18.67,26.54 180 top
C7  15.11,29.21 0 top
C8  11.43,13.97 90 top
C9  19.05,13.97 90 top
C10  15.24,8.89 90 top
C11  19.05,3.81 90 top
C12  11.43,3.81 90 top
C13  40.64,10.16 180 top
C14  35.56,15.62 270 top
C15  54.61,41.91 0 top
C16  49.53,39.37 180 top
C17  44.45,43.18 0 top
C18  10.16,26.67 180 top
C19  5.08,27.94 180 top
C20  5.08,31.75 180 top
C21  14.99,26.54 0 top
C22  36.83,44.45 0 top
C23  58.17,25.15 0 top
C24  81.03,33.53 180 top
C25  61.34,39.88 270 top
C26  74.93,16.51 0 top
C27  58.42,34.29 0 top
C28  20.32,48.64 90 top
C29  36.83,46.99 0 top
C30  20.32,38.1 180 top
D2  38.1,17.78 90 top
D4  20.61,20.81 270 top
GND  7.62,6.47 0 bottom
H1  39.37,5.08 0 top
H2  49.53,5.08 0 top
I2C  14.43,49.93 270 top
J5  1.91,40.74 270 top
L1  24.13,12.7 0 top
L2  29.21,33.02 0 top
M1  73.66,49.53 180 top
M2  73.66,6.35 0 top
PROG  27.94,26.67 180 top
Q3  17.22,23.07 0 top
R1  20.2,35.56 0 top
R2  29.21,29.59 0 top
R3  46.6,50.22 0 top
R4  57.15,31.75 180 top
R5  57.15,29.21 180 top
R6  46.63,48.54 0 top
R7  63.5,39.88 270 top
R8  74.93,19.05 0 top
R9  62.23,20.32 90 top
R10  77.47,38.1 270 top
R11  22.99,22.79 180 top
R12  20.32,29.21 180 top
R13  34.29,49.53 0 top
R14  54.61,44.45 0 top
R15  54.61,46.99 0 top
R16  21.93,49.75 0 bottom
R17  21.94,52.24 0 bottom
RUN  6.07,47.42 90 top
SERIAL  10.29,48.64 270 top
SERVO  3.3,18.29 270 top
STAT  50.62,50.22 270 top
U1  10.16,20.32 180 top
U2  8.89,30.48 180 top
U3  15.24,33.02 90 top
U4  27.94,43.18 180 top
U5  49.53,43.18 270 top
U6  36.83,52.07 180 top
U7  44.45,39.37 0 top
U8  69.85,29.21 270 top
U9  52.07,16.51 270 top
X2  36.7,37.21 270 top

### Tracks (layer width: path | path; a pad name or v marks a point on that pad's centre or on a via)
1V8  (via drill 0.35)
  Top 0.203: v39.37,50.8 39.37,51.44 38.98,51.82 U6.2 | v44.45,44.45 46.61,44.45 47.28,43.78 U5.8 | v45.72,40.64 45.72,40.48 U7.6 | v48.26,38.1 48.68,38.52 C16.2 48.53,39.52 U5.13 | U5.22 55.26,43.38 55.46,43.18
  Top 0.406: v55.5,40.77 55.5,41.87 C15.2 55.46,43.18 R14.2 R15.2
  Top 0.508: U2.5 7.35,29.21 v6.35,29.21 5.93,28.79 C19.1
  Route15 0.406: v6.35,29.21 6.35,34.29 16.51,44.45 16.51,48.26 19.05,50.8 v39.37,50.8 44.45,45.72 v44.45,44.45 44.45,41.91 v45.72,40.64 v48.26,38.1 52.83,38.1 v55.5,40.77
  Bottom 0.203: 1.8V.TP 5.97,28.83 v6.35,29.21
5V
  Top 0.305: 10.23,19.21 9.43,18.41 U1.8
  Top 0.406: 10.23,19.21 10.23,22.85 11.47,24.08 17.21,24.08 Q3.3
  Top 0.813: SERVO.2 4.57,18.29 7.75,15.11
  Top 1.778: 10.23,19.21 10.23,17.6 7.75,15.11 3.56,10.92 5V_OUT.1
  Bottom 0.203: 5V.TP 3.44,10.94 5V_OUT.1
  pour Top (no thermals): 10.1,20.01 13.72,20.01 13.72,18.16 10.1,18.16
5V_HEATSINK  (via drill 0.35)
  other vias: 43.18,26.67 44.45,26.67 45.72,26.67 46.99,26.67 48.26,26.67 49.53,26.67 50.8,26.67 50.8,25.4 49.53,25.4 48.26,25.4 46.99,25.4 45.72,25.4 44.45,25.4 45.72,24.13 46.99,24.13 48.26,24.13 49.53,24.13 50.8,24.13 50.8,22.86 49.53,22.86 48.26,22.86 46.99,22.86
  pour Route15: 37.72,30.48 46.23,21.97 52.32,21.97 52.32,26.42 51.05,27.69 51.05,29.84 47.24,33.66 40.89,33.66
  pour Bottom: 37.72,30.48 46.23,21.97 52.32,21.97 52.32,26.42 51.05,27.69 51.05,29.84 47.24,33.66 40.89,33.66
5VIN  (via drill 0.35)
  Top 1.778: C9.+ 16.51,12.7 15.33,13.88 15.11,14.1 13.72,12.7 C8.+
  Top 2.032: 15.33,13.88 15.33,20.34 13.96,21.71 13.01,21.71 12.95,21.77 U1.4
  Route15 2.54: v49.53,11.43 49.53,17.78 48.26,19.05 30.48,19.05 L1.1 C9.+ C8.+
  other vias: 49.53,12.7 49.53,10.16 48.26,11.43 48.26,10.16
  pour Top (no thermals): 49.15,15.37 49.15,13.21 47.88,11.94 47.88,9.78 49.91,9.78 49.91,15.37
  pour Route15: 48.9,13.21 47.88,12.19 47.88,9.78 50.04,9.78 50.67,10.41 50.67,13.21
  pour Top (no thermals): 12.06,20.7 13.97,20.7 13.97,23.3 12.06,23.3
!RESET  (via drill 0.35)
  Top 0.203: U4.52 25.69,37.12 24.13,35.56 R1.2 v25.4,35.56 | PROG.3 26.25,27.09 C1.2
  Route15 0.203: PROG.3 25.4,27.94 v25.4,35.56
+3V3  (via drill 0.35)
  Top 0.203: U4.48 22.5,39.43 | U4.8 34.45,42.93 34.46,42.93 | U4.16 v34.29,46.93 | 35.92,46.93 C29.1 | v28.32,36.58 27.69,37.21 U4.56 | U4.21 29.69,48.87 29.97,49.15 v29.97,49.91 | U6.7 36.45,51.82 36.7,51.56 36.7,51.09 R13.2 | v80.01,40.64 78.32,38.95 R10.1 | U7.1 43.06,39.87 41.91,41.02 v41.91,43.31 | v21.59,36.83 20.5,36.83 19.35,35.68 R1.1 | v27.81,28.45 27.81,29.04 R2.1 | U4.4 32.97,40.94 33.65,41.62 v33.65,41.66 | U4.34 22.15,46.43 20.89,47.69 C28.1 | 14.02,26.56 C21.1 | v18.92,47.62 18.92,51.03 19.97,52.08 v19.98,52.06
  Top 0.305: 22.5,39.43 21.38,38.31 C30.1 | 34.46,42.93 C22.1
  Top 0.406: C29.1 35.14,47.83 R13.2
  Top 0.508: U3.5 12.53,30.66 | 12.53,30.66 11.4,29.53 | 11.4,29.53 U2.1 | C18.1 11.4,27.06 11.4,29.53 | 12.53,30.66 v12.57,30.61 13.97,29.21 C7.1 14.04,28.98 C21.1 | v21.59,36.83 21.38,37.04 21.38,38.31 | v34.29,46.93 35.92,46.93 | C29.1 C22.1 | R9.1 62.06,19.3 62.06,17.95 v62.23,17.78 | v54.48,16.38 67.06,3.81 77.47,3.81 78.66,5 M2.6 | v18.92,47.62 18.99,47.69 C28.1
  Route15 0.203: v28.32,36.58 28.45,36.45 28.45,29.08 v27.81,28.45 | v33.65,41.66 31.49,41.66 31.24,41.91
  Route15 0.508: v11.68,29.84 12.45,30.61 v12.57,30.61 12.57,36.7 12.7,36.83 | v18.92,47.62 17.53,46.23 17.53,41.66 12.7,36.83 | 12.7,36.83 v21.59,36.83 28.07,36.83 v28.32,36.58 31.24,39.5 31.24,41.91 31.24,45.72 | 31.24,45.72 31.24,45.85 29.97,47.12 v29.97,49.91 | 31.24,45.72 32.45,46.93 v34.29,46.93 40.7,46.93 41.91,45.72 v41.91,43.31 41.91,38.1 44.45,35.56 52.07,35.56 | 52.07,35.56 66.04,49.53 M1.6 71.2,52.07 80.01,52.07 82.55,49.53 82.55,43.18 v80.01,40.64 | v54.48,16.38 54.48,33.15 52.07,35.56
  Bottom 0.203: 3.3V.TP 11.05,25.06 12.57,26.59 v12.57,30.61 | v18.92,47.62 21.05,49.75 R16.2 | v19.98,52.06 20.91,52.06 R17.2
  Bottom 0.508: v54.48,16.38 55.88,17.78 v62.23,17.78 | v18.92,47.62 15.46,47.62 I2C.3
A5  (via drill 0.35)
  Top 0.203: U4.15 33.6,46.43 33.95,46.09 34.93,46.09 v34.94,46.1 | v44.54,49.12 45.2,49.12 R6.1
  Route15 0.203: v34.94,46.1 39.47,46.1 v39.78,45.78
  Bottom 0.203: v39.78,45.78 41.2,45.78 v44.54,49.12
D6  (via drill 0.35)
  Top 0.203: U4.37 21.21,44.93 v21.08,45.06
  Bottom 0.203: v21.08,45.06 21.08,43.94 13.97,36.83 6.45,36.83 2.58,32.96 2.58,21.55 SERVO.1
D9
  Top 0.203: U4.38 20.7,44.43 20.19,44.94 18.43,44.94 17.78,45.59 17.78,52.07 20.07,54.36 52.32,54.36 63.5,43.18 79.12,43.18 81.15,41.15 81.15,36.83 79.71,35.38 U8.43
D10
  Top 0.203: U4.41 18.29,42.93 17.3,43.92 17.3,52.34 19.79,54.84 52.6,54.84 63.78,43.66 79.27,43.66 81.64,41.3 81.64,36.68 81.15,36.2 79.69,34.73 U8.42
D11  (via drill 0.3, 0.35)
  Top 0.203: U4.42 22.47,42.43 22.36,42.54 21.3,42.54 v21.07,42.32 | v60.58,23.7 63.08,23.7 U8.20
  Bottom 0.203: v21.07,42.32 21.1,42.32 21.33,42.54 24.26,42.54 46.86,19.94 56.81,19.94 v60.58,23.7
D12  (via drill 0.3, 0.35)
  Top 0.203: U4.43 v21.96,41.92 | v21.96,41.92 | v61.85,22.99 63.05,22.99 U8.21
  Bottom 0.203: v21.96,41.92 24.11,41.92 46.74,19.3 58.17,19.3 v61.85,22.99
D34  (via drill 0.35)
  Top 0.203: U4.23 28.69,48.53 28.19,49.02 v28.19,49.53 v28.2,49.54 | v62.23,36.83 63.02,36.03 U8.1
  Bottom 0.203: v28.2,49.54 28.2,52.08 28.83,52.7 54.99,52.7 62.23,45.47 v62.23,36.83
D36  (via drill 0.35)
  Top 0.203: U4.17 31.94,47.88 v33.24,47.88 | v44.25,50.23 45.74,50.23 R3.1
  Route15 0.203: v33.24,47.88 35.57,47.88 36.83,49.14 v39.12,49.14
  Bottom 0.203: v39.12,49.14 43.16,49.14 v44.25,50.23
D37  (via drill 0.35)
  Top 0.203: U4.18 31.19,48.08 31.75,48.64 v32.13,48.64 | v50.8,31.75 54.13,28.42 54.13,23.6 62.58,15.15 76.08,15.15 80.37,19.43 80.37,22.25 79.12,23.49 77.56,23.49 77.36,23.68 U8.25
  Bottom 0.203: v32.13,48.64 33.91,48.64 v50.8,31.75
D38  (via drill 0.35)
  Top 0.203: U4.19 30.69,48.34 31.37,49.02 v31.37,49.53 31.37,49.66 | U8.23 77.83,22.39 v77.85,22.4 | v52.07,29.21 53.47,27.81 53.47,23.11 62.1,14.48 76.2,14.48 v83.44,21.72
  Bottom 0.203: v31.37,49.53 34.42,49.53 52.2,31.75 52.2,29.34 v52.07,29.21 | v77.85,22.4 82.75,22.4 v83.44,21.72
D39  (via drill 0.35)
  Top 0.203: U4.20 30.19,48.6 30.73,49.15 30.73,51.56 v31.24,52.07 | v61.47,35.43 61.98,34.92 62.17,34.73 U8.3
  Bottom 0.203: v31.24,52.07 54.74,52.07 61.47,45.34 v61.47,35.43
D+
  Top 0.203: J5.3 17.43,40.74 17.74,40.43 U4.46
D-
  Top 0.203: J5.2 17.66,41.39 18.12,40.93 U4.45
EN  (via drill 0.35)
  Top 0.203: U3.3 17.72,33.97 v18.1,33.59 21.17,30.52 R12.1 21.75,28.63 21.75,25.91 23.52,24.13 33.07,24.13 34.61,22.59 v34.65,22.55 | U2.3 11.24,31.43 | 11.24,31.43 v11.3,31.5 | v8.39,38.05 11.24,35.2 11.24,31.43 | v52.36,14.23 50.9,14.23 U9.7
  Bottom 0.203: v11.3,31.5 13.4,33.59 v18.1,33.59 | RUN.2 7.93,46.83 7.93,38.58 8.05,38.58 8.39,38.23 v8.39,38.05 | v34.65,22.55 34.65,22.53 42.85,14.33 52.33,14.33 52.36,14.3 v52.36,14.23
GND  (via drill 0.3, 0.35)  (2 unrouted)
  Top 0.203: 22.16,47.56 v22.23,47.5 22.79,46.93 U4.33 | v21.21,39.62 21.52,39.93 U4.47 24.69,39.93 U4.EXP | U4.54 26.69,35.01 v26.84,34.86 | v29.08,49.28 29.21,49.15 29.21,47.65 U4.22 | v38.23,49.91 38.2,49.91 U6.1 | U5.9 46.78,43.38 v46.54,43.62 | v46.35,41.91 46.35,39.75 45.97,39.37 U7.5 U7.2 | U5.18 50.53,39.52 C16.1 v51.56,39.37 | U5.20 53.09,42.58 C15.1 | C25.1 R7.1 64.73,40.73 v64.77,40.77 | R5.1 60.71,29.21 v61.09,28.83 | C1.1 24.55,27.09 PROG.4 | U4.7 36.84,42.43 37.21,42.8 | R11.1 23.87,22.76 v23.87,21.18 | v50.6,51.31 51.67,50.24 STAT.C 51.69,50.21 ACT.C
  Top 0.305: v7.01,39.44 J5.5
  Top 0.406: U3.2 15.62,33.02
  Top 0.508: C13.2 v38.1,10.16 | U1.5 v5.84,22.23 | U1.6 v5.84,20.95 | U2.2 8.89,30.48 | C30.2 20.99,39.62 v21.21,39.62 | C29.2 37.72,47.03 v37.72,48.26 37.72,44.49 C22.2 37.72,44.41 37.72,43.31 37.21,42.8 | C15.1 53.76,40.81 v53.72,40.77 | U8.EH@3 72.86,19.05 R8.1 C26.1 | C17.1 43.62,43.16 v43.62,42.1 | C28.2 20.77,49.59 22.16,48.2 22.16,47.56
  Top 0.762: v8.89,33.02 8.89,30.48 8.89,27.09 C18.2
  Top 0.813: C27.1 v55.88,34.29 | C6.2 17.72,27.87 v17.65,27.94 v17.65,29.21
  Top 1.016: 15.62,33.02 v15.24,32.64 15.24,31.11 15.96,30.39 C7.2 15.94,29.18 C21.2 | C5.2 25.93,32.07 C3.2 24.06,32 v22.73,32 22.61,32 v22.61,33.02 | v5.46,33.15 4.28,33.15 4.23,33.1 C20.2 | v4.19,26.8 4.19,27.9 C19.2 | v10.03,33.02 v8.89,33.02 v7.75,33.02
  Top 2.286: 62.32,29.27 62.38,29.21 U8.EH@1 77.23,29.21 77.25,29.19
  Bottom 0.203: C12.- 10.04,6.47 GND.TP
  other vias: 46.99,12.7 46.99,11.43 46.99,10.16 45.72,10.16 45.72,11.43 69.85,29.21 67.31,29.21 67.31,31.75 67.31,34.29 72.39,34.29 69.85,36.83 72.39,31.75 72.39,29.21 69.85,26.67 72.39,24.13 67.31,24.13 69.85,21.59 67.31,26.67 72.39,26.67 69.85,24.13 69.85,31.75 69.85,34.29 77.85,29.46 78.61,28.96 77.85,28.57 61.72,29.46 61.98,28.57 15.88,27.94 15.62,30.73 38.37,37.19
  pour Route2: -1.27,-2.54 86.36,-2.54 86.36,57.15 -1.27,57.15
  pour Top (no thermals): 46.61,15.37 46.61,13.21 45.34,11.94 45.34,9.78 47.37,9.78 47.37,15.37
  pour Top (no thermals): 76.07,30.35 77.85,30.35 78.99,29.21 78.99,28.7 78.49,28.19 76.07,28.19
  pour Top (no thermals): 63.63,30.35 61.85,30.35 60.71,29.21 60.71,28.45 61.09,28.07 62.23,28.07 62.36,28.19 63.63,28.19
  pour Top: 34.67,40.64 39.37,40.64 39.37,33.78 34.67,33.78
  pour Bottom: 66.17,35.43 68.2,37.47 71.63,37.47 73.53,35.56 73.53,23.11 71.5,21.08 67.94,21.08 66.17,22.86
  pour Route15: 66.17,35.43 68.2,37.47 71.63,37.47 73.53,35.56 73.53,23.11 71.5,21.08 67.94,21.08 66.17,22.86
I5V_SENSE  (via drill 0.35)
  Top 0.203: v5.84,19.68 U1.7 | v34.29,25.4 34.29,30.48 32.78,31.98 32.78,35.56 30.69,37.66 U4.62
  Bottom 0.203: 13.09,19.68 12.7,19.68 | 12.7,19.68 v5.84,19.68 | 12.7,19.68 17.14,24.13 33.02,24.13 v34.29,25.4
ICM_INT
  Top 0.203: U5.12 47.97,42.16 47.58,42.16 46.99,41.57 46.99,39.37 46.49,38.87 U7.4
IM1_SENSE
  Top 0.203: U8.2 62.53,35.38 61.34,36.58 61.34,37.21 | 61.34,37.21 C25.2 R7.2 | U4.3 33.57,40.43 34.42,41.27 39.5,41.27 40.51,40.26 40.51,39.5 42.8,37.21 61.34,37.21
IM2_SENSE  (via drill 0.35)
  Top 0.203: U8.24 78.95,23.04 79.88,22.1 79.88,20.32 78.61,19.05 R8.2 C26.2 75.49,16.51 74.73,15.76 62.73,15.76 54.74,23.75 54.74,29.2 49.59,34.35 41.86,34.35 v41.57,34.64 | U4.11 33.17,44.43 v33.78,43.81
  Bottom 0.203: v33.78,43.81 34.8,42.8 36.45,42.8 41.57,37.68 v41.57,34.64
INT  (via drill 0.35)
  Top 0.203: U4.14 33.35,45.93 33.95,45.32 v34.13,45.32 | v43.16,37.96 43.16,38.72 43.31,38.87 U7.3
  Bottom 0.203: v43.16,37.96 35.85,45.27 34.18,45.27 v34.13,45.32
M1+  (via drill 0.35)
  Bottom 1.778: v61.09,31.5 63.25,31.5 64.77,33.02 64.77,35.81 76.66,47.7 M1.2
  other vias: 61.98,31.11 61.85,32
  pour Top (no thermals): 63.63,32.26 62.23,32.26 61.98,32.51 61.59,32.51 60.71,31.62 60.71,31.24 61.21,30.73 63.63,30.73
M1-  (via drill 0.35)
  Bottom 1.778: v78.74,31.5 77.39,31.5 74.85,34.04 74.85,42.93 78.66,46.74 M1.1
  other vias: 77.85,32 77.98,31.11
  pour Top (no thermals): 75.95,32.26 77.47,32.26 77.72,32.51 78.36,32.51 79.12,31.75 79.12,31.24 78.61,30.73 75.95,30.73
M1_ENC_A  (via drill 0.35)
  Top 0.203: v24.71,52.72 24.69,52.7 U4.31
  Bottom 0.203: v24.71,52.72 25.73,53.75 55.47,53.75 62.1,47.12 68.25,47.12 M1.5
M1_ENC_B  (via drill 0.35)
  Top 0.203: U4.24 28.19,48.26 v27.3,49.15
  Bottom 0.203: v27.3,49.15 27.3,52.58 27.94,53.21 55.24,53.21 61.85,46.61 69.74,46.61 M1.4
M1_STATUS
  Top 0.203: U8.44 77.47,36.91 | 77.47,36.91 R10.2 | U4.36 21.84,45.43 21.46,45.81 18.7,45.81 18.29,46.23 18.29,51.69 20.45,53.85 52.07,53.85 63.25,42.67 74.04,42.67 76.2,40.51 76.2,38.1 77.39,36.91 77.47,36.91
M2+  (via drill 0.35)
  Bottom 1.778: v78.74,26.92 76.45,26.92 74.93,25.4 74.93,21.59 70.66,17.32 M2.2
  other vias: 77.85,27.43 77.85,26.42
  pour Top (no thermals): 76.07,27.69 78.23,27.69 78.61,27.69 79.12,27.18 79.12,26.54 78.61,26.04 77.72,26.04 77.47,26.04 77.34,26.16 76.07,26.16
M2-  (via drill 0.35)
  Bottom 1.778: v60.96,26.8 63.37,26.8 64.77,25.4 64.77,21.16 68.66,17.27 M2.1
  other vias: 61.85,27.3 61.85,26.42
  pour Top (no thermals): 63.63,27.69 61.21,27.69 60.58,27.05 60.58,26.54 61.09,26.04 62.23,26.04 62.36,26.16 63.63,26.16
M2_ENC_A  (via drill 0.35)
  Top 0.203: U4.49 24.19,38.29 v23.62,37.72
  Bottom 0.203: v23.62,37.72 24.64,36.7 25.95,36.7 46.53,16.13 52.45,16.13 66.04,2.54 74.93,2.54 76.66,4.27 M2.5
M2_ENC_B  (via drill 0.35)
  Top 0.203: U4.50 24.69,37.79 v24.77,37.72
  Bottom 0.203: v24.77,37.72 25.27,37.21 26.13,37.21 46.45,16.89 52.58,16.89 66.17,3.3 73.03,3.3 74.66,4.94 M2.4
M2_STATUS  (via drill 0.3, 0.35)
  Top 0.203: U8.22 62.23,21.52 R9.2 58.37,21.17 55.39,24.15 55.39,29.61 50,35 42.46,35 41.88,35.58 41.14,35.58 35.16,29.6 v35.16,29.57 | U4.44 22.32,41.43 22.21,41.32 20.77,41.32 v20.18,41.91
  Bottom 0.203: v35.16,29.57 29.21,35.52 28.48,35.52 27.69,36.31 27.69,36.32 22.73,41.28 20.82,41.28 v20.18,41.91
N$1
  Top 0.203: R3.2 STAT.A
N$2
  Top 0.203: R6.2 49.48,48.54 ACT.A
N$5
  Top 0.203: X2.P$1 34.8,37.92 34.29,37.92 32.78,39.43 U4.1
  Top 0.305: C2.1 36.36,35.67 X2.P$1
N$7
  Top 0.203: X2.P$2 34.42,38.41 32.9,39.93 U4.2
  Top 0.305: C4.1 36.7,39.54 X2.P$2
N$11
  Top 0.203: U4.55 27.19,36.44
  Top 0.305: 27.19,36.44 27.43,36.2
  Top 0.406: 27.43,36.2 30.34,33.29 L2.P$2
N$12
  Top 0.508: U2.4 6.25,31.43 C20.1
N$13
  Top 0.203: U6.8 34.43,51.32 33.44,50.33 R13.1
N$15
  Top 0.203: U5.10 45.5,42.98 C17.2
N$18
  Top 0.203: U6.3 39.44,52.32 45.28,46.48 52.2,46.48 53.76,44.92 R14.1 53.09,43.78 U5.23
N$19  (via drill 0.35)
  Top 0.203: U6.4 39.71,52.82 45.54,46.99 52.58,46.99 v52.64,46.93 52.7,46.99 R15.1 | U5.24 51.73,44.83 v52.45,44.83
  Bottom 0.203: v52.64,46.93 52.45,46.74 v52.45,44.83
N$30
  Top 0.203: U8.41 77.26,34.09 77.46,34.28 81.12,34.28 C24.1
N$31
  Top 0.203: U8.19 58.13,24.34 C23.1
N$94
  Top 0.508: C14.1 35.6,16.51 45.09,16.51 45.72,15.88 U9.3
N$96
  Top 0.508: C14.2 35.56,12.7
  Top 2.54: L1.2 35.56,12.7 D2.C 41.91,12.7
  pour Top (no thermals): 43.18,15.24 40.64,15.24 40.64,11.43 43.43,11.43 43.43,14.99
RX_D0  (via drill 0.35)
  Top 0.203: U4.40 18.8,43.43 v18.8,43.69
  Bottom 0.203: v18.8,43.69 10.06,43.69 8.38,45.36 8.38,50.56 9.01,51.18 SERIAL.1
SCL  (via drill 0.35)
  Top 0.203: U4.30 25.19,51.23 v25.53,51.56 27.3,53.34 36.2,53.34 36.58,52.96 36.58,52.58 36.32,52.32 U6.6
  Bottom 0.203: I2C.2 21.73,51.2 | 21.73,51.2 25.16,51.2 v25.53,51.56 | R16.1 22.78,50.14 21.73,51.2
SDA  (via drill 0.35)
  Top 0.203: U4.29 25.69,50.55 v26.67,51.53 27.97,52.83 35.45,52.83 U6.5
  Route15 0.203: I2C.1 14.44,53.72 25,53.72 26.67,52.05 v26.67,51.53
  Bottom 0.203: v26.67,51.53 25.93,52.27 25.25,52.27 24.7,51.72 23.31,51.72 R17.1
SWCLK
  Top 0.203: U4.57 28.19,37.6 31.5,34.3 31.5,31.03 R2.2 30.06,28.87 29.21,28.02 PROG.2
SWDIO
  Top 0.203: U4.58 28.7,38.72 28.7,37.72 32,34.42 32,26.92 PROG.1
TX_D1  (via drill 0.35)
  Top 0.203: U4.39 20.06,43.93 v19.81,44.18
  Bottom 0.203: v19.81,44.18 19.54,44.45 12.95,44.45 12.2,45.2 12.2,47.84 11.4,48.64 SERIAL.2
VBAT  (via drill 0.35)
  Top 0.203: C23.2 v60.58,25.15 | v78.74,33.53 C24.2 | v60.71,33.4 59.05,31.75 R4.1
  Top 0.508: C13.1 44.45,10.16
  Top 1.016: U9.2 44.45,10.16 43.7,9.41
  Top 2.032: H1.B2,8 43.7,9.41
  other vias: 60.71,34.29 61.72,34.29 61.72,33.4 77.85,33.53 61.59,25.15 77.85,25.02 78.74,25.27 78.49,24.26 79.38,24.51
  pour Route15 (isolate 0.203): 8.89,0 50.8,0 59.69,8.89 78.74,8.89 82.55,12.7 82.55,35.56 77.47,35.56 77.47,19.05 74.93,16.51 64.77,16.51 62.23,19.05 62.23,35.56 59.69,35.56 55.88,31.75 55.88,13.97 50.8,8.89 8.89,8.89
  pour Top (no thermals): 58.67,34.67 61.98,34.67 62.48,34.16 63.63,34.16 63.63,32.64 62.61,32.64 62.23,33.02 58.67,33.02
  pour Top (no thermals): 76.07,33.53 77.22,33.53 77.34,33.66 77.6,33.91 79.12,33.91 79.25,33.78 79.25,33.27 79.12,33.15 77.98,33.15 77.72,33.15 77.6,33.15 77.09,32.64 76.07,32.64
  pour Top (no thermals): 63.63,24.89 62.36,24.89 62.1,24.64 59.94,24.64 59.94,25.65 63.63,25.65
  pour Top (no thermals): 76.07,25.78 77.09,25.78 77.22,25.65 79.25,25.65 79.63,25.27 79.63,24.38 79.25,24 77.6,24 77.34,24.26 76.07,24.26
VBAT_SENSE  (via drill 0.35)
  Top 0.203: R4.2 56.3,30.48 | 56.3,30.48 R5.2 | U4.12 33.48,44.93 33.91,44.5 34.54,44.5 v34.6,44.44 | 56.3,30.48 55.75,30.48 50.29,35.94 v42.8,35.94
  Bottom 0.203: v42.8,35.94 42.8,37.21 41.4,38.61 41.4,38.99 35.95,44.44 v34.6,44.44
VBUS  (via drill 0.35)
  Top 0.305: R11.2 22.14,20.49 D4.A
  Top 0.406: J5.1 5.27,42.04 5.57,42.34 v6.14,42.34
  Top 0.508: Q3.1 16.27,21.83 16.47,21.83 18.29,20 v19.05,20 19.05,19.47 19.55,18.96 D4.A
  Route15 0.406: v19.05,20 14.29,20 4.19,30.1 4.19,35.06 6.14,37.01 v6.14,42.34
VDDCORE1
  Top 0.203: U4.53 26.19,34.22
  Top 0.305: 26.19,34.22 26.29,34.12
  Top 0.406: 26.29,34.12 C5.1 | C5.1 24.23,33.87 C3.1 | C5.1 27.23,33.87 L2.P$1
VHI
  Top 0.508: Q3.2 20.02,22.07 D4.C 19.5,23.78 19.49,26.42 C6.1 19.37,26.8 19.37,29.11 R12.2 19.37,29.11 19.37,30.16 17.46,32.07 U3.1

### Text on the board
tNames: SDA | short to / disable | SCL | +3.3V | GND/TX/RX | +3V3 / CH_A / CH_B / GND / M1 + / M1 - | +Z | +Y | M2 - / M2 + / GND / CH_B / CH_A / +3V3 | +X
bNames: 2x DC Motor Cont. w/ Encoder + IMU | Summer 2020 | Arduino Board: / Feather M4 | 6 Servo header signal pin / 9 M1 input control pin 1 / 10 M1 input control pin 2 / 11 M2 input control pin 2 / 12 M2 input control pin 1 / 13 M2 status (low=fault condition) | 25 M1 status (low=fault condition) / 34 M1 disable, active high / 36 STAT LED, active high / 37 M2 enable, active high / 38 M2 disable, active high / 39 M1 enable, active high | SWDIO / SWCLK / RESET / GND | A0 M1 current sense / A2 M2 current sense / A3 voltage divider output from VBAT / A6 Current sense on 5v rail | 15 IMU Interrupt / 19 ACT LED, active high / 21 I2C clock / 22 I2C data / 23 M2 encoder channel A / 24 M2 encoder channel B | 0 Serial header on board (Serial1) / 1 Serial header on board (Serial1) / 3 Motor 1 encoder channel B / 4 M1 encoder channel A | VBAT+ | GND | Chip ID: / ATSAMD51J19A